# EasyEDA Pro project GController.eprj, schematic NController, sheets 5 to 10 of 17

## Sheets
5 RS485: Create Date: 2024-09-24
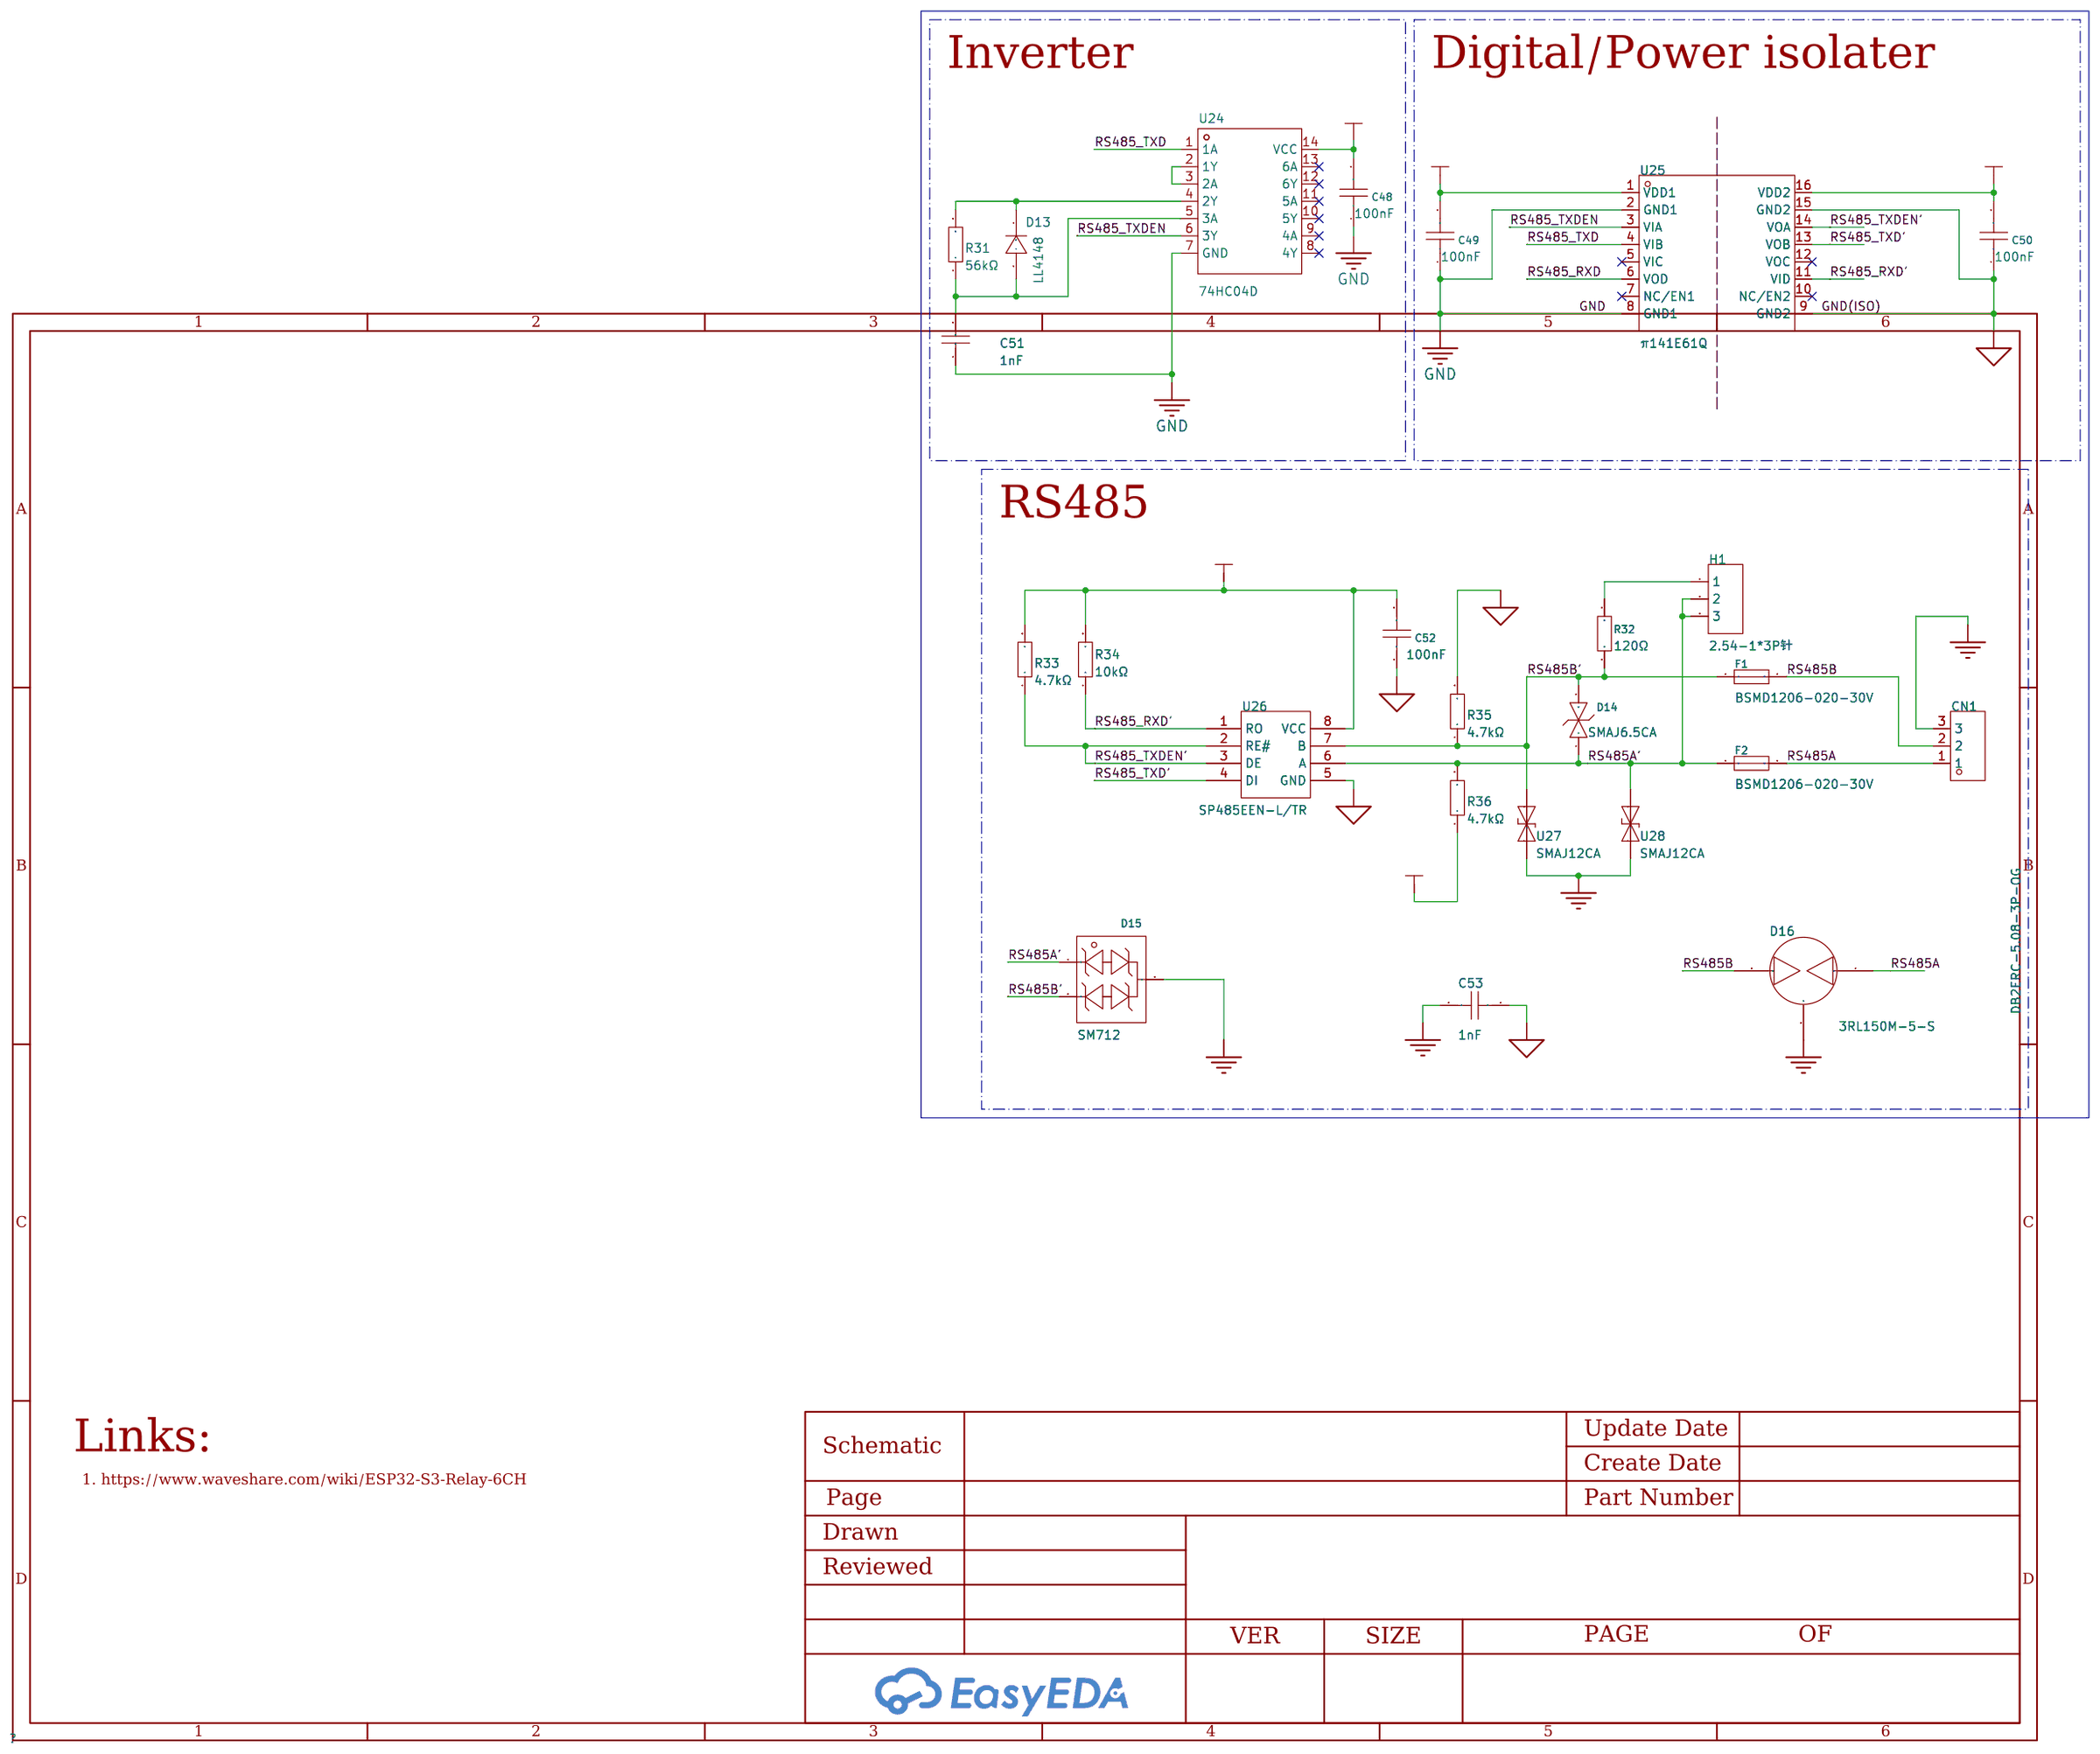
[diagram p4: RS485]
6 RTC: Create Date: 2024-09-24
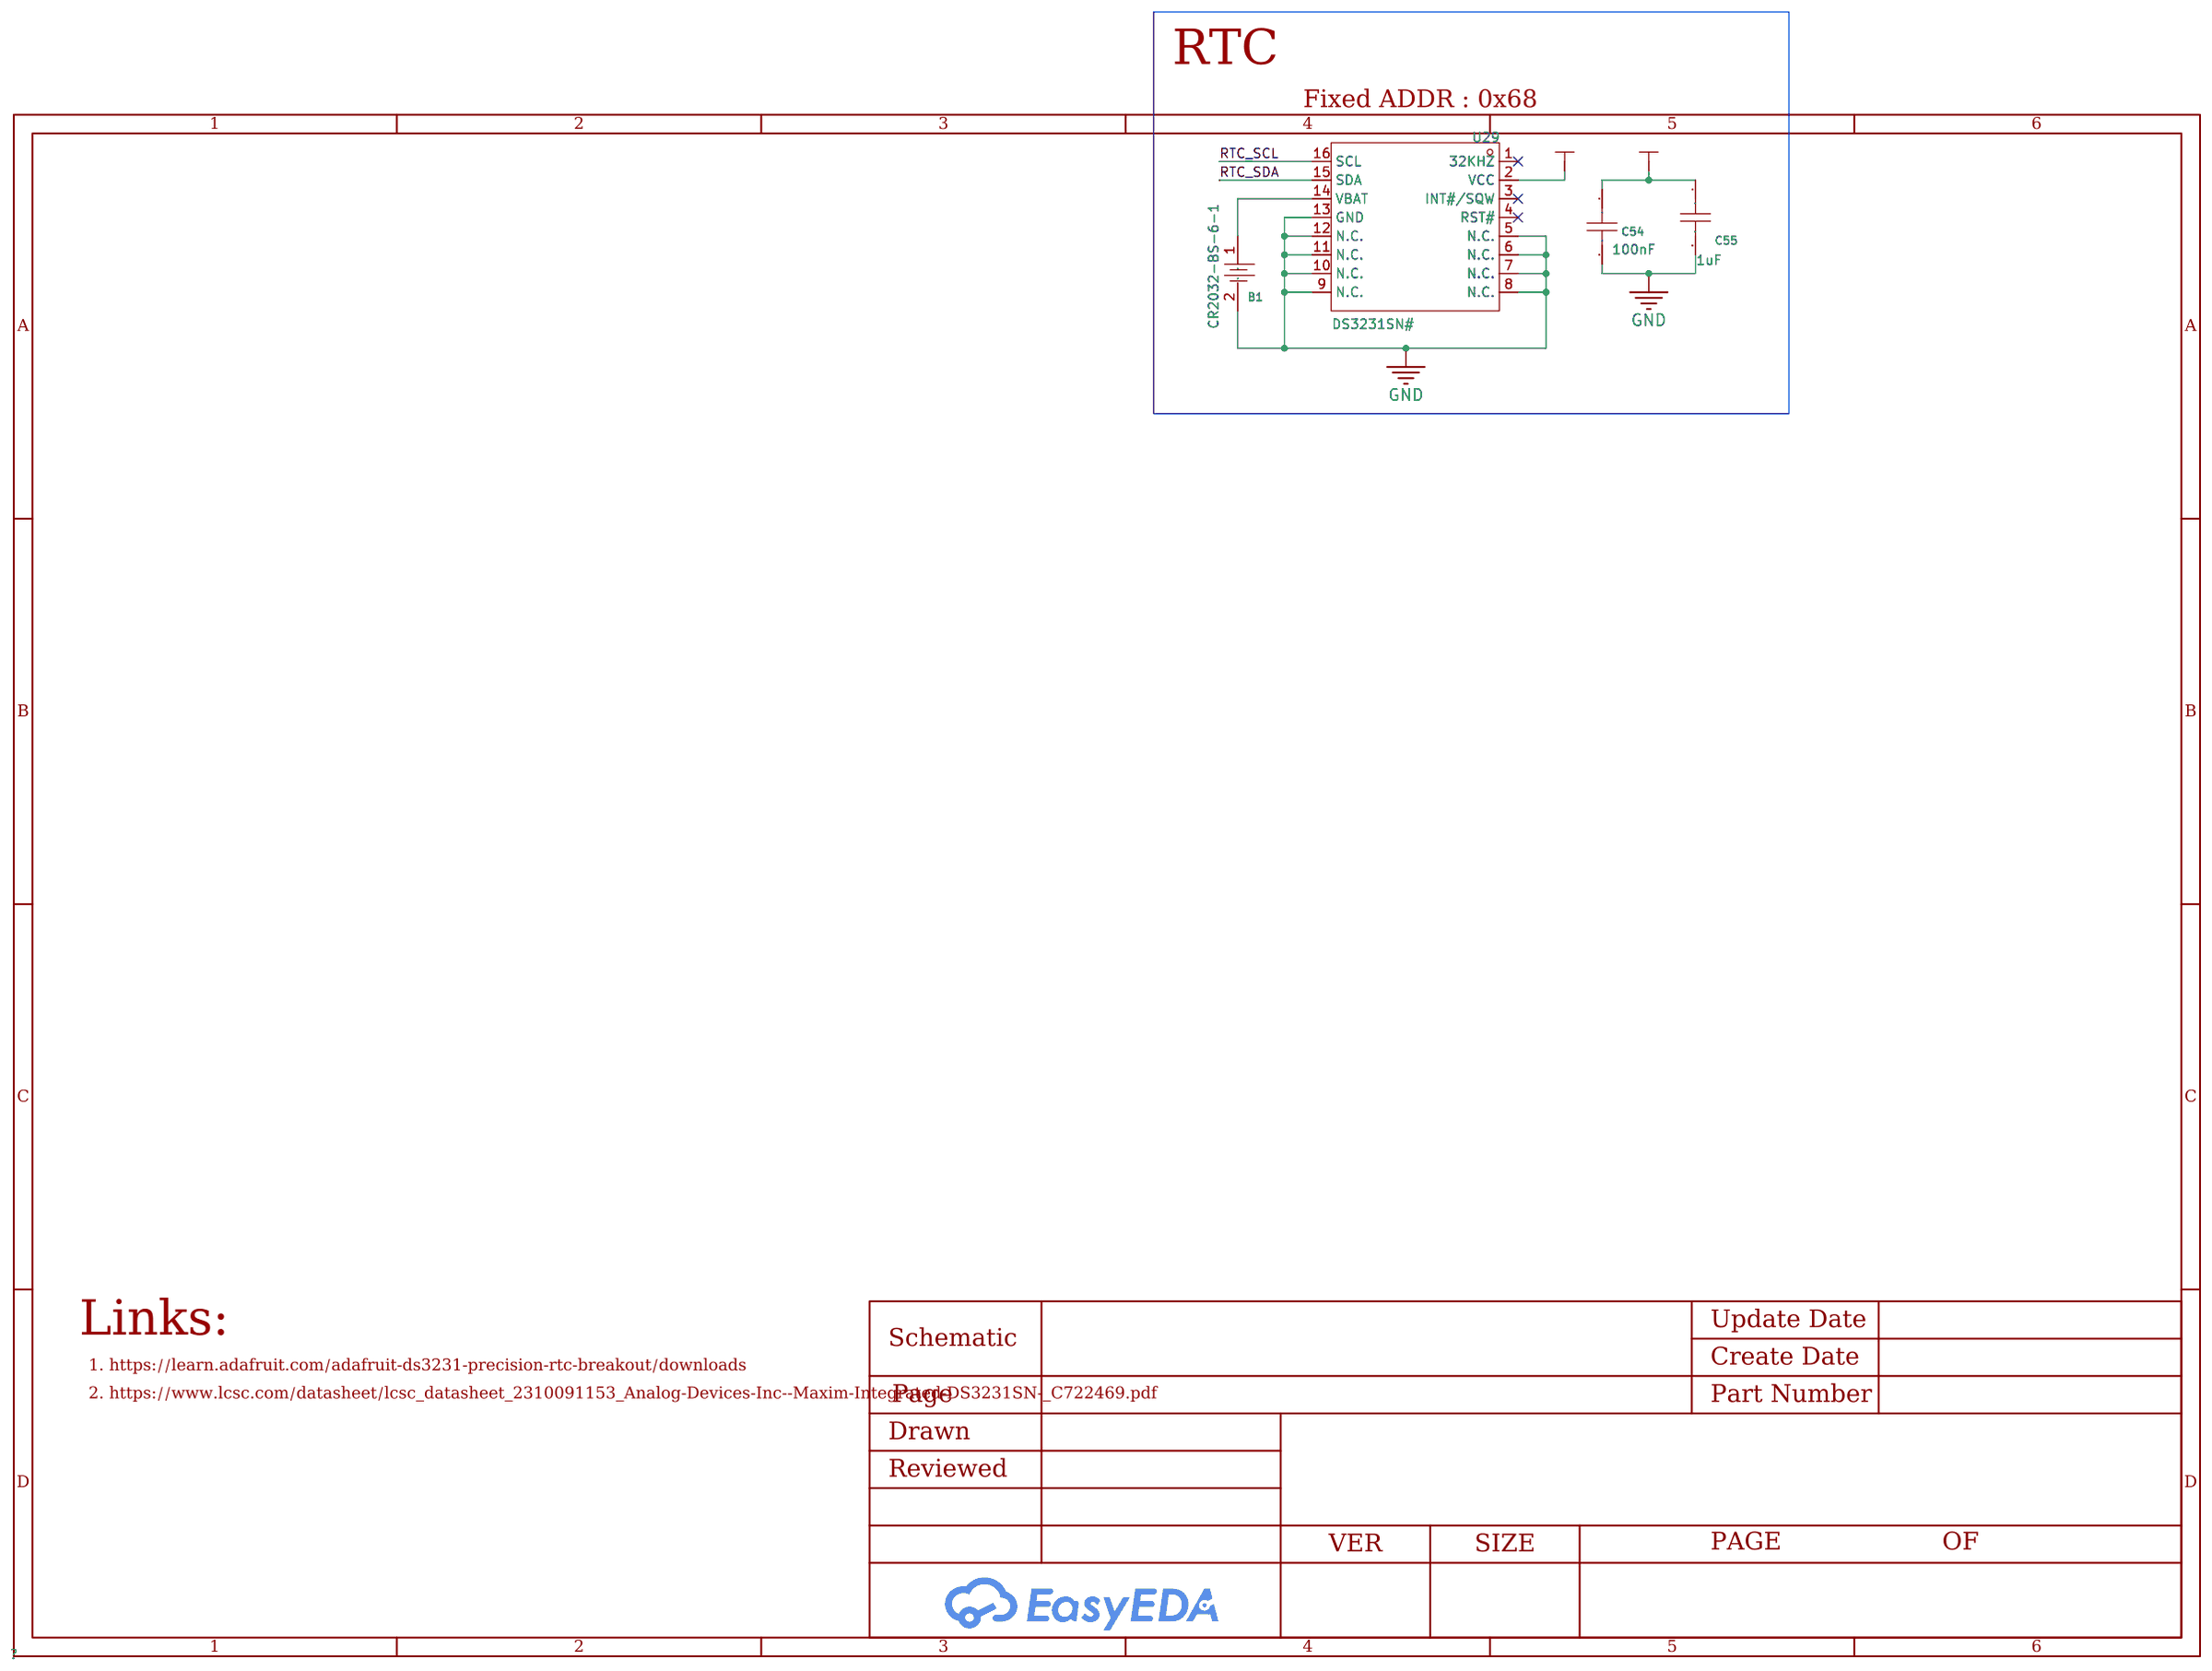
[diagram p5: RTC]
7 Storage: Create Date: 2024-09-24
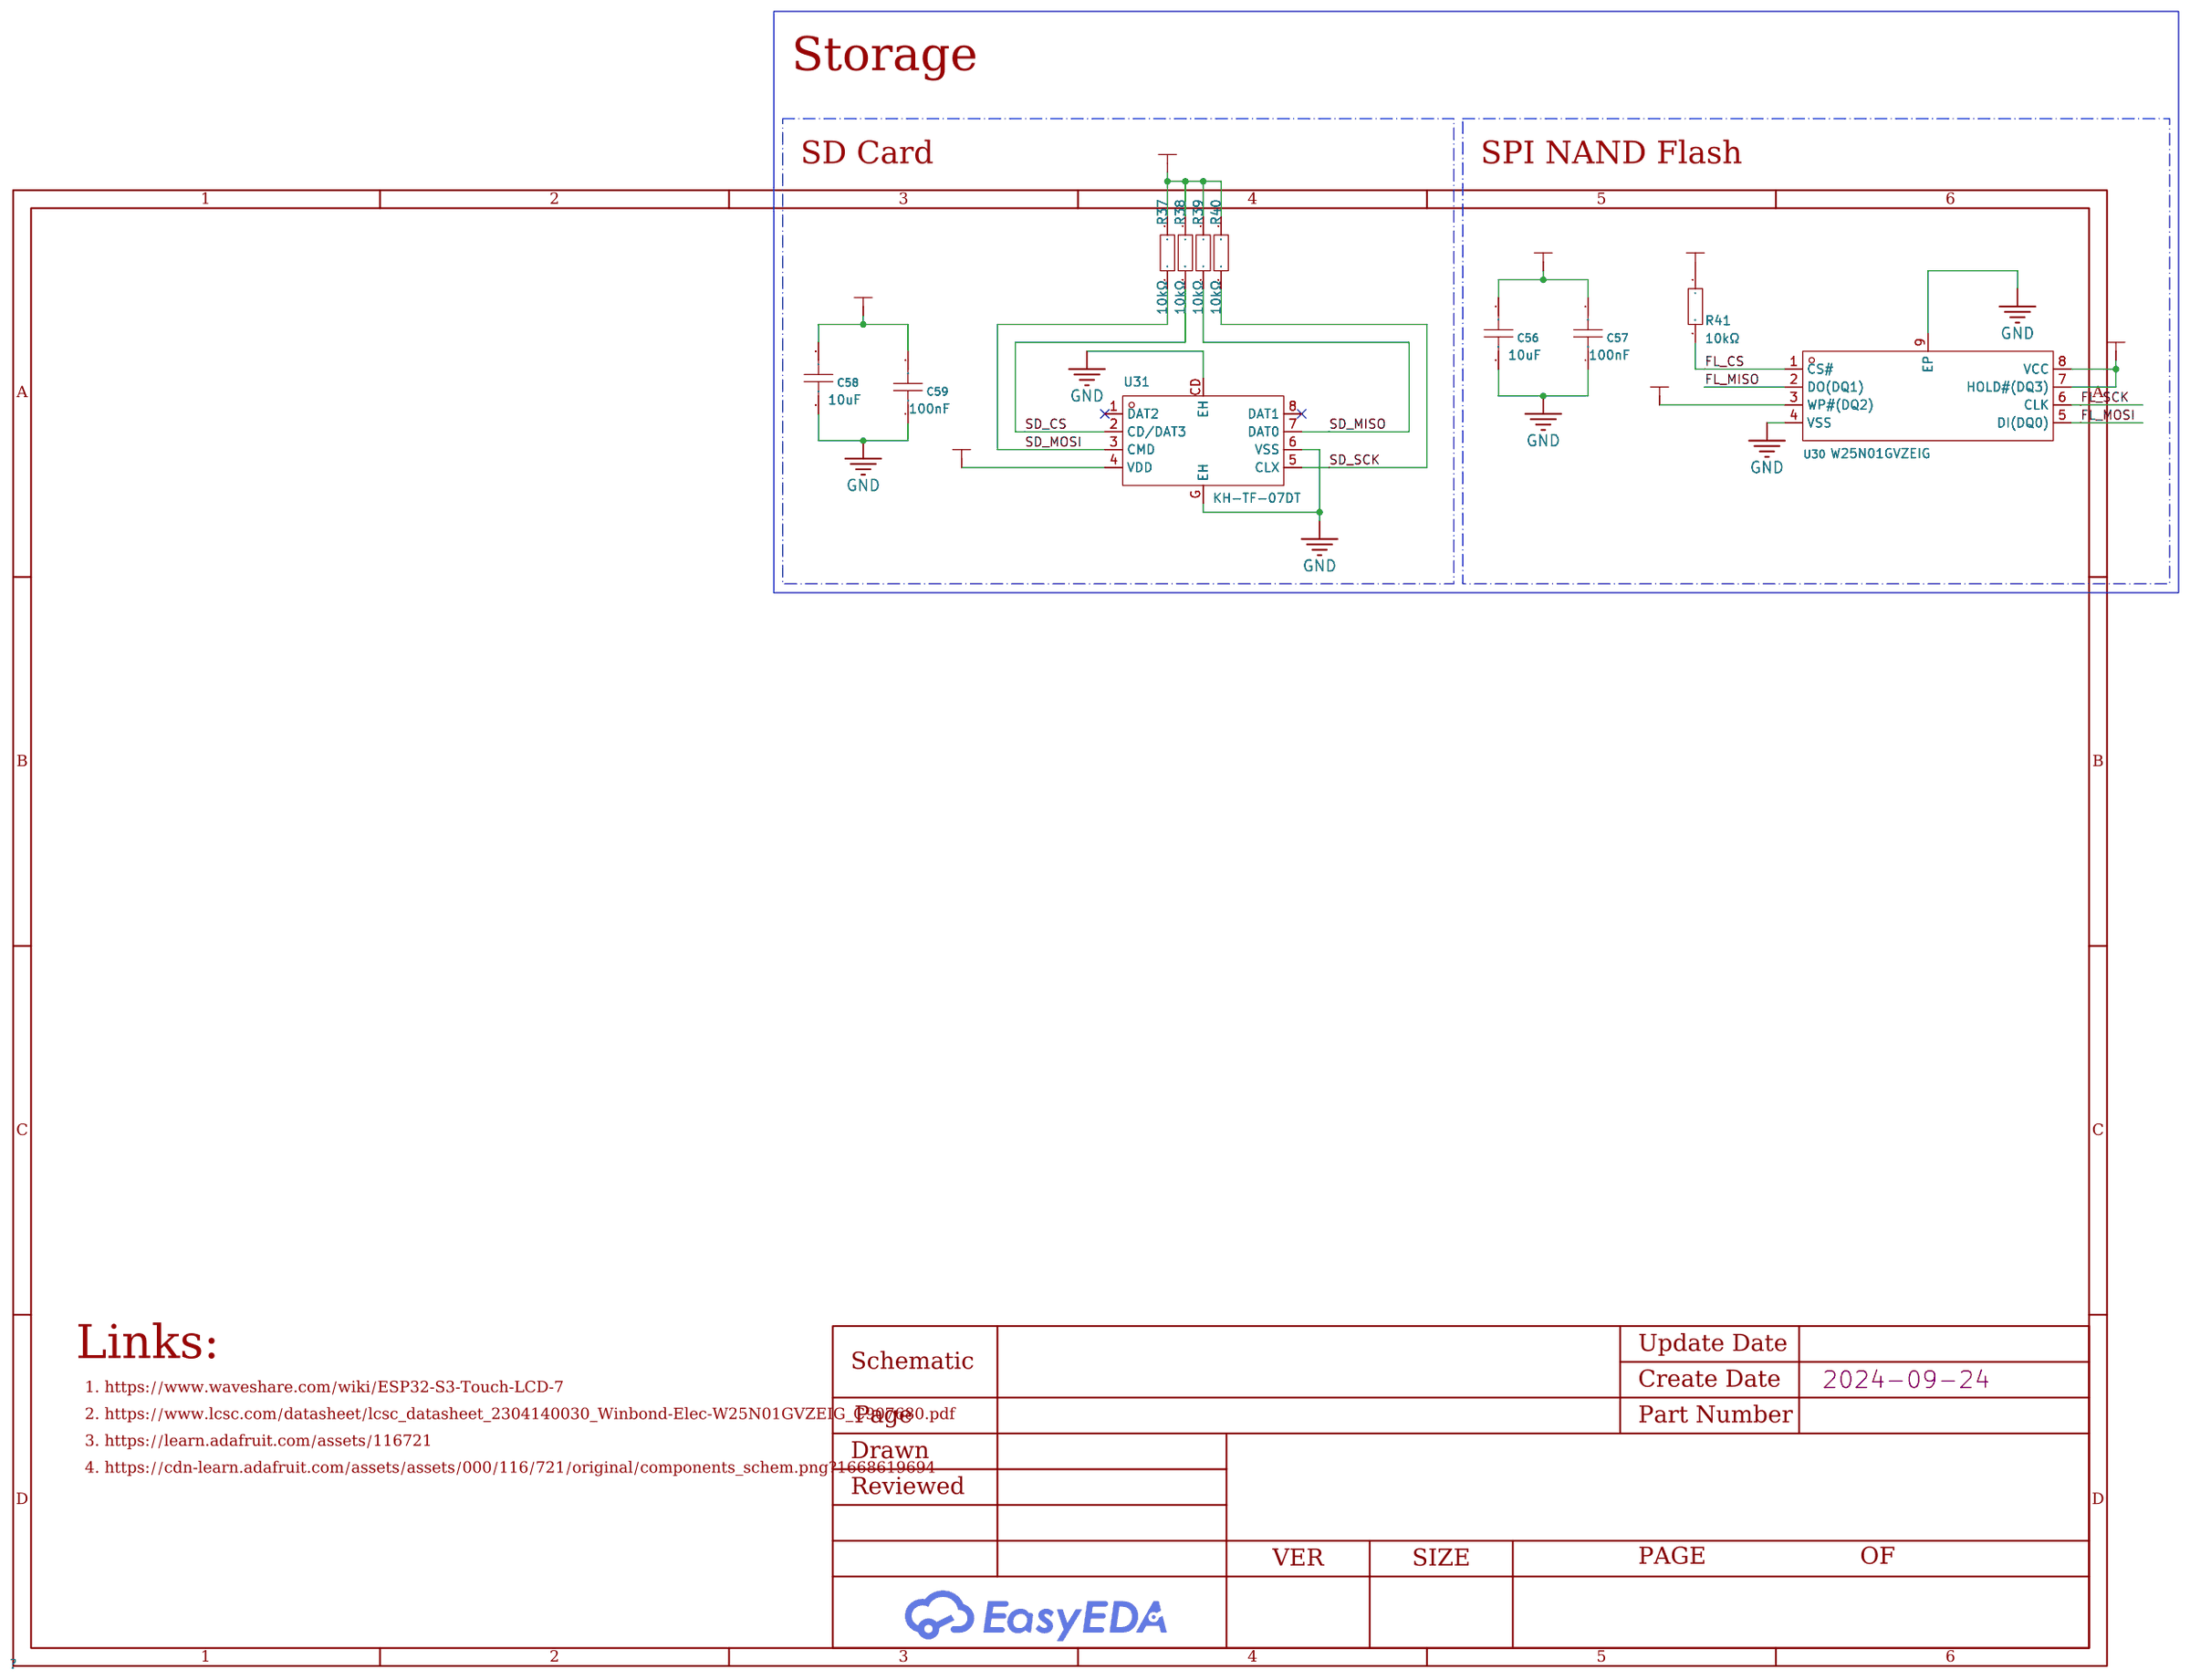
[diagram p6: Storage]
8 IO-Expander: Create Date: 2024-09-24
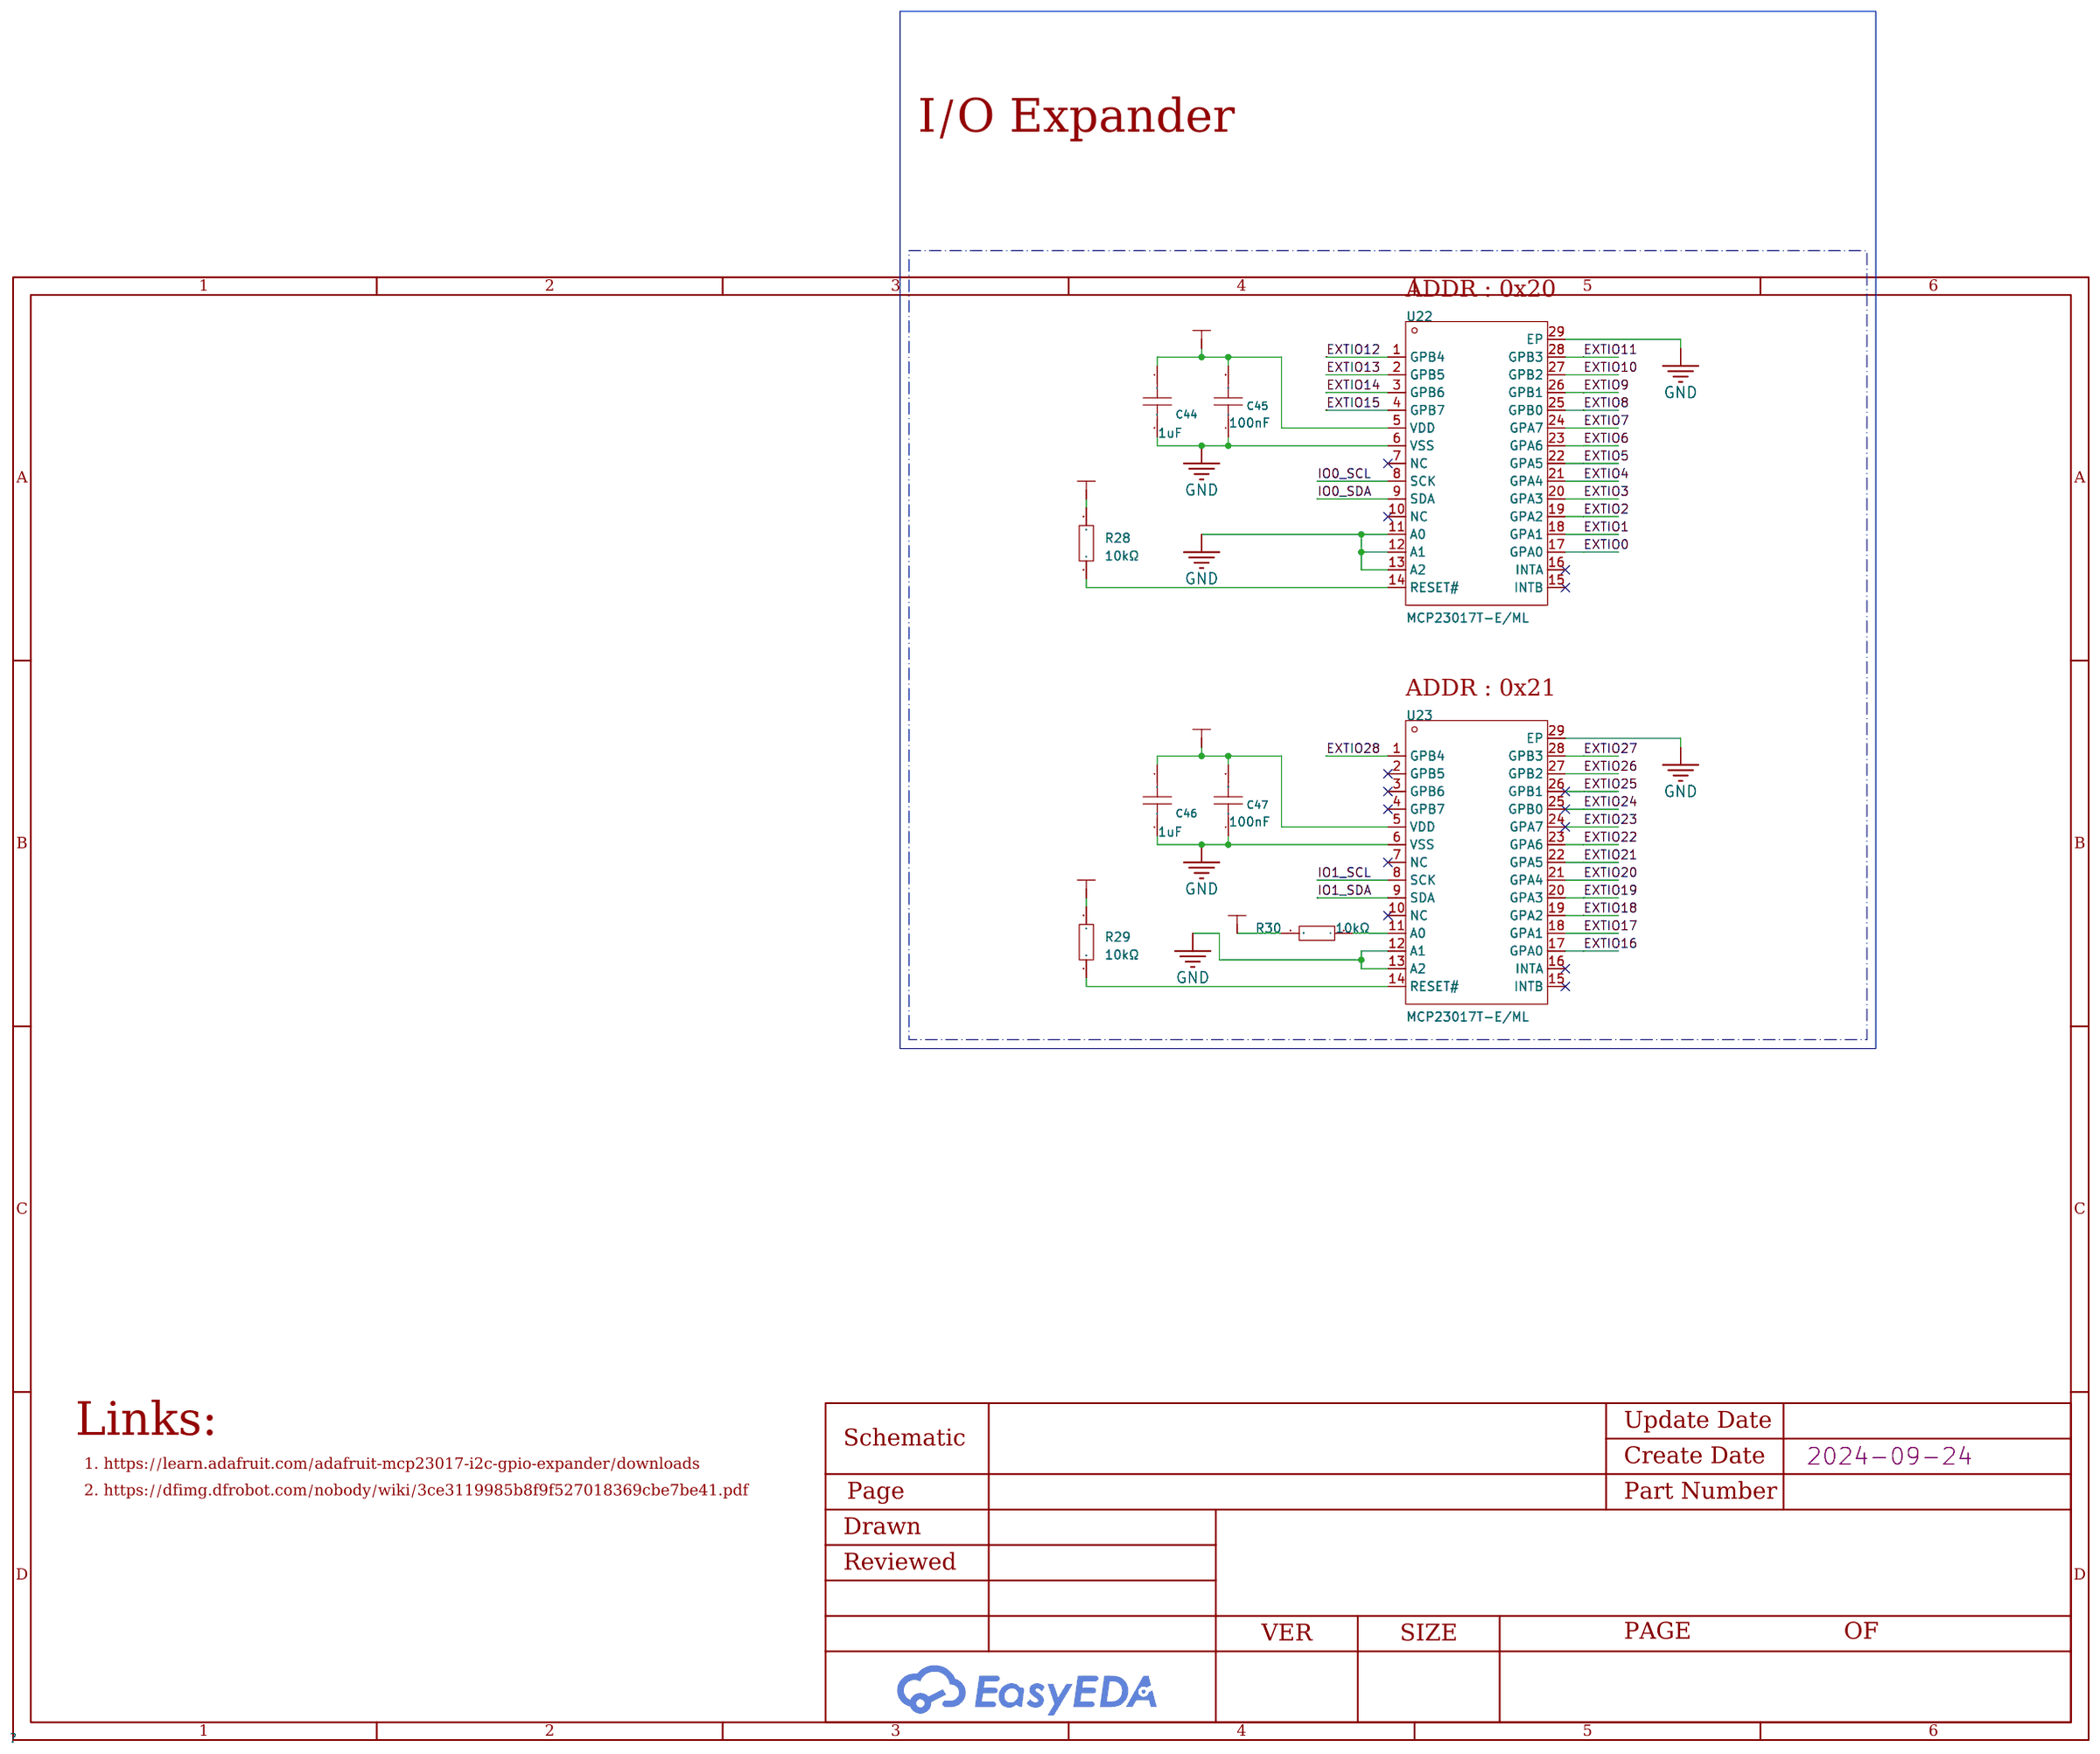
[diagram p7: IO-Expander]
9 Digital-Output: Create Date: 2024-09-24
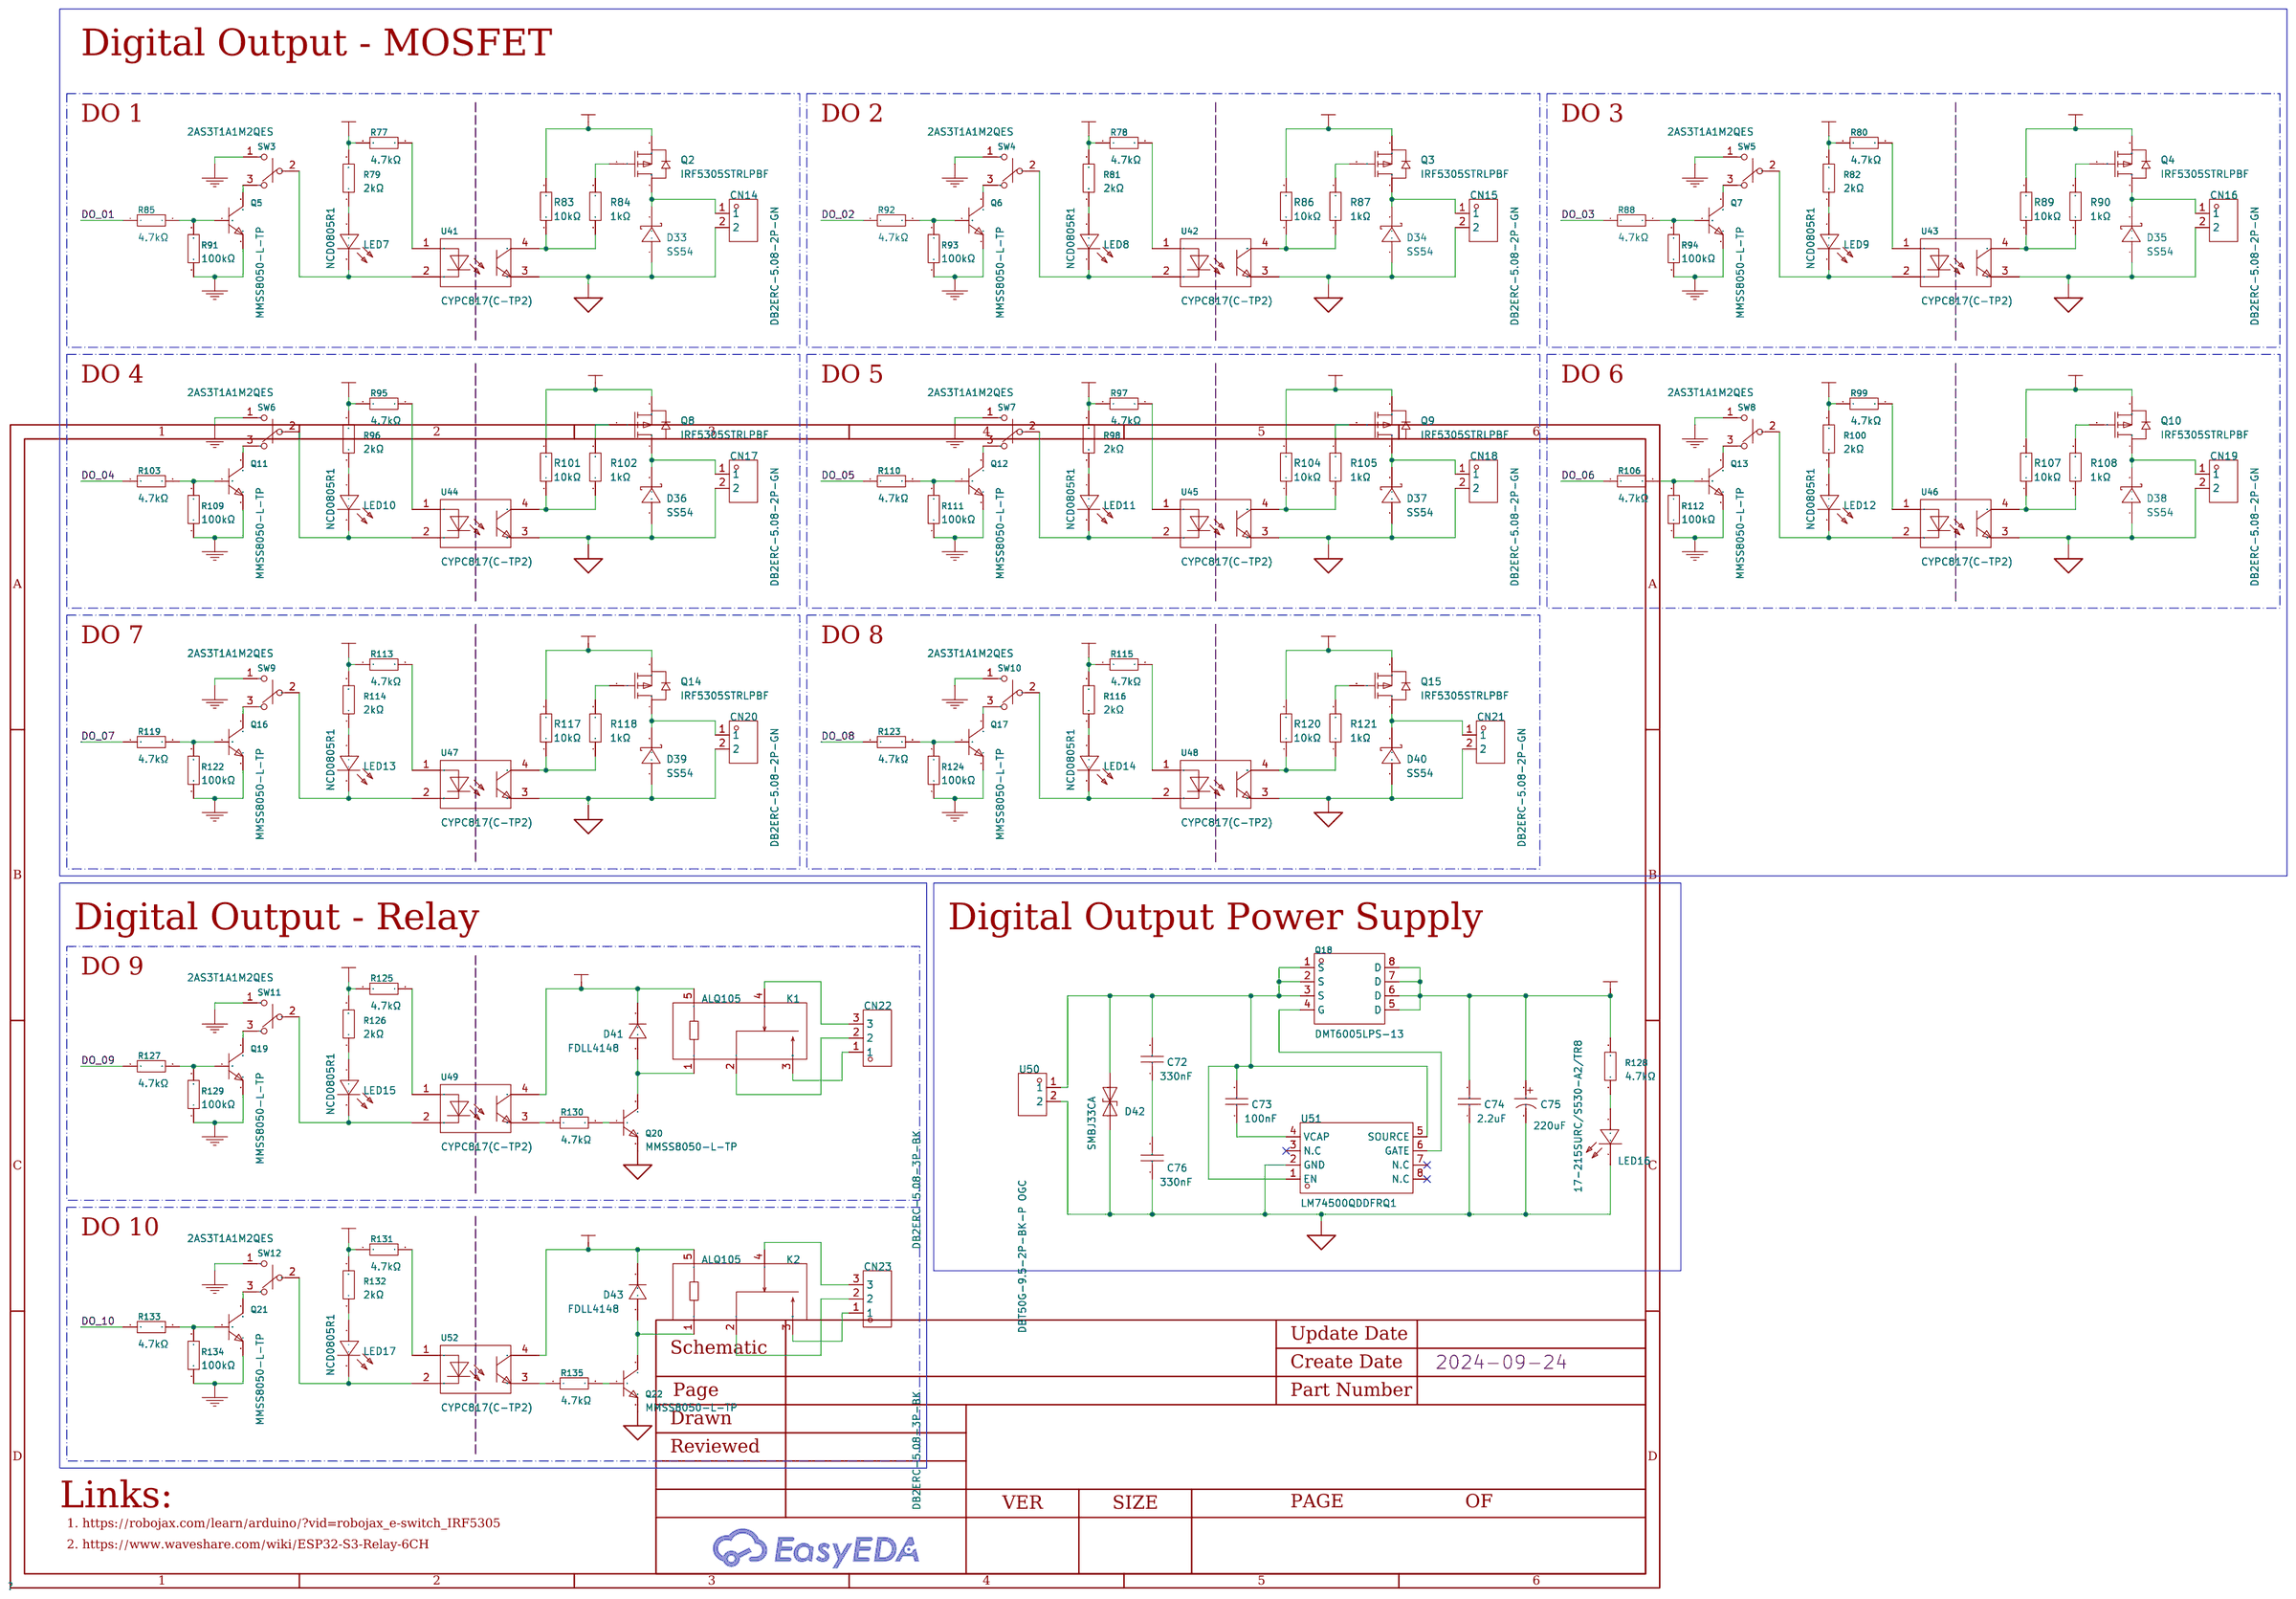
[diagram p8: Digital-Output]
10 Buzzer: Create Date: 2024-09-24
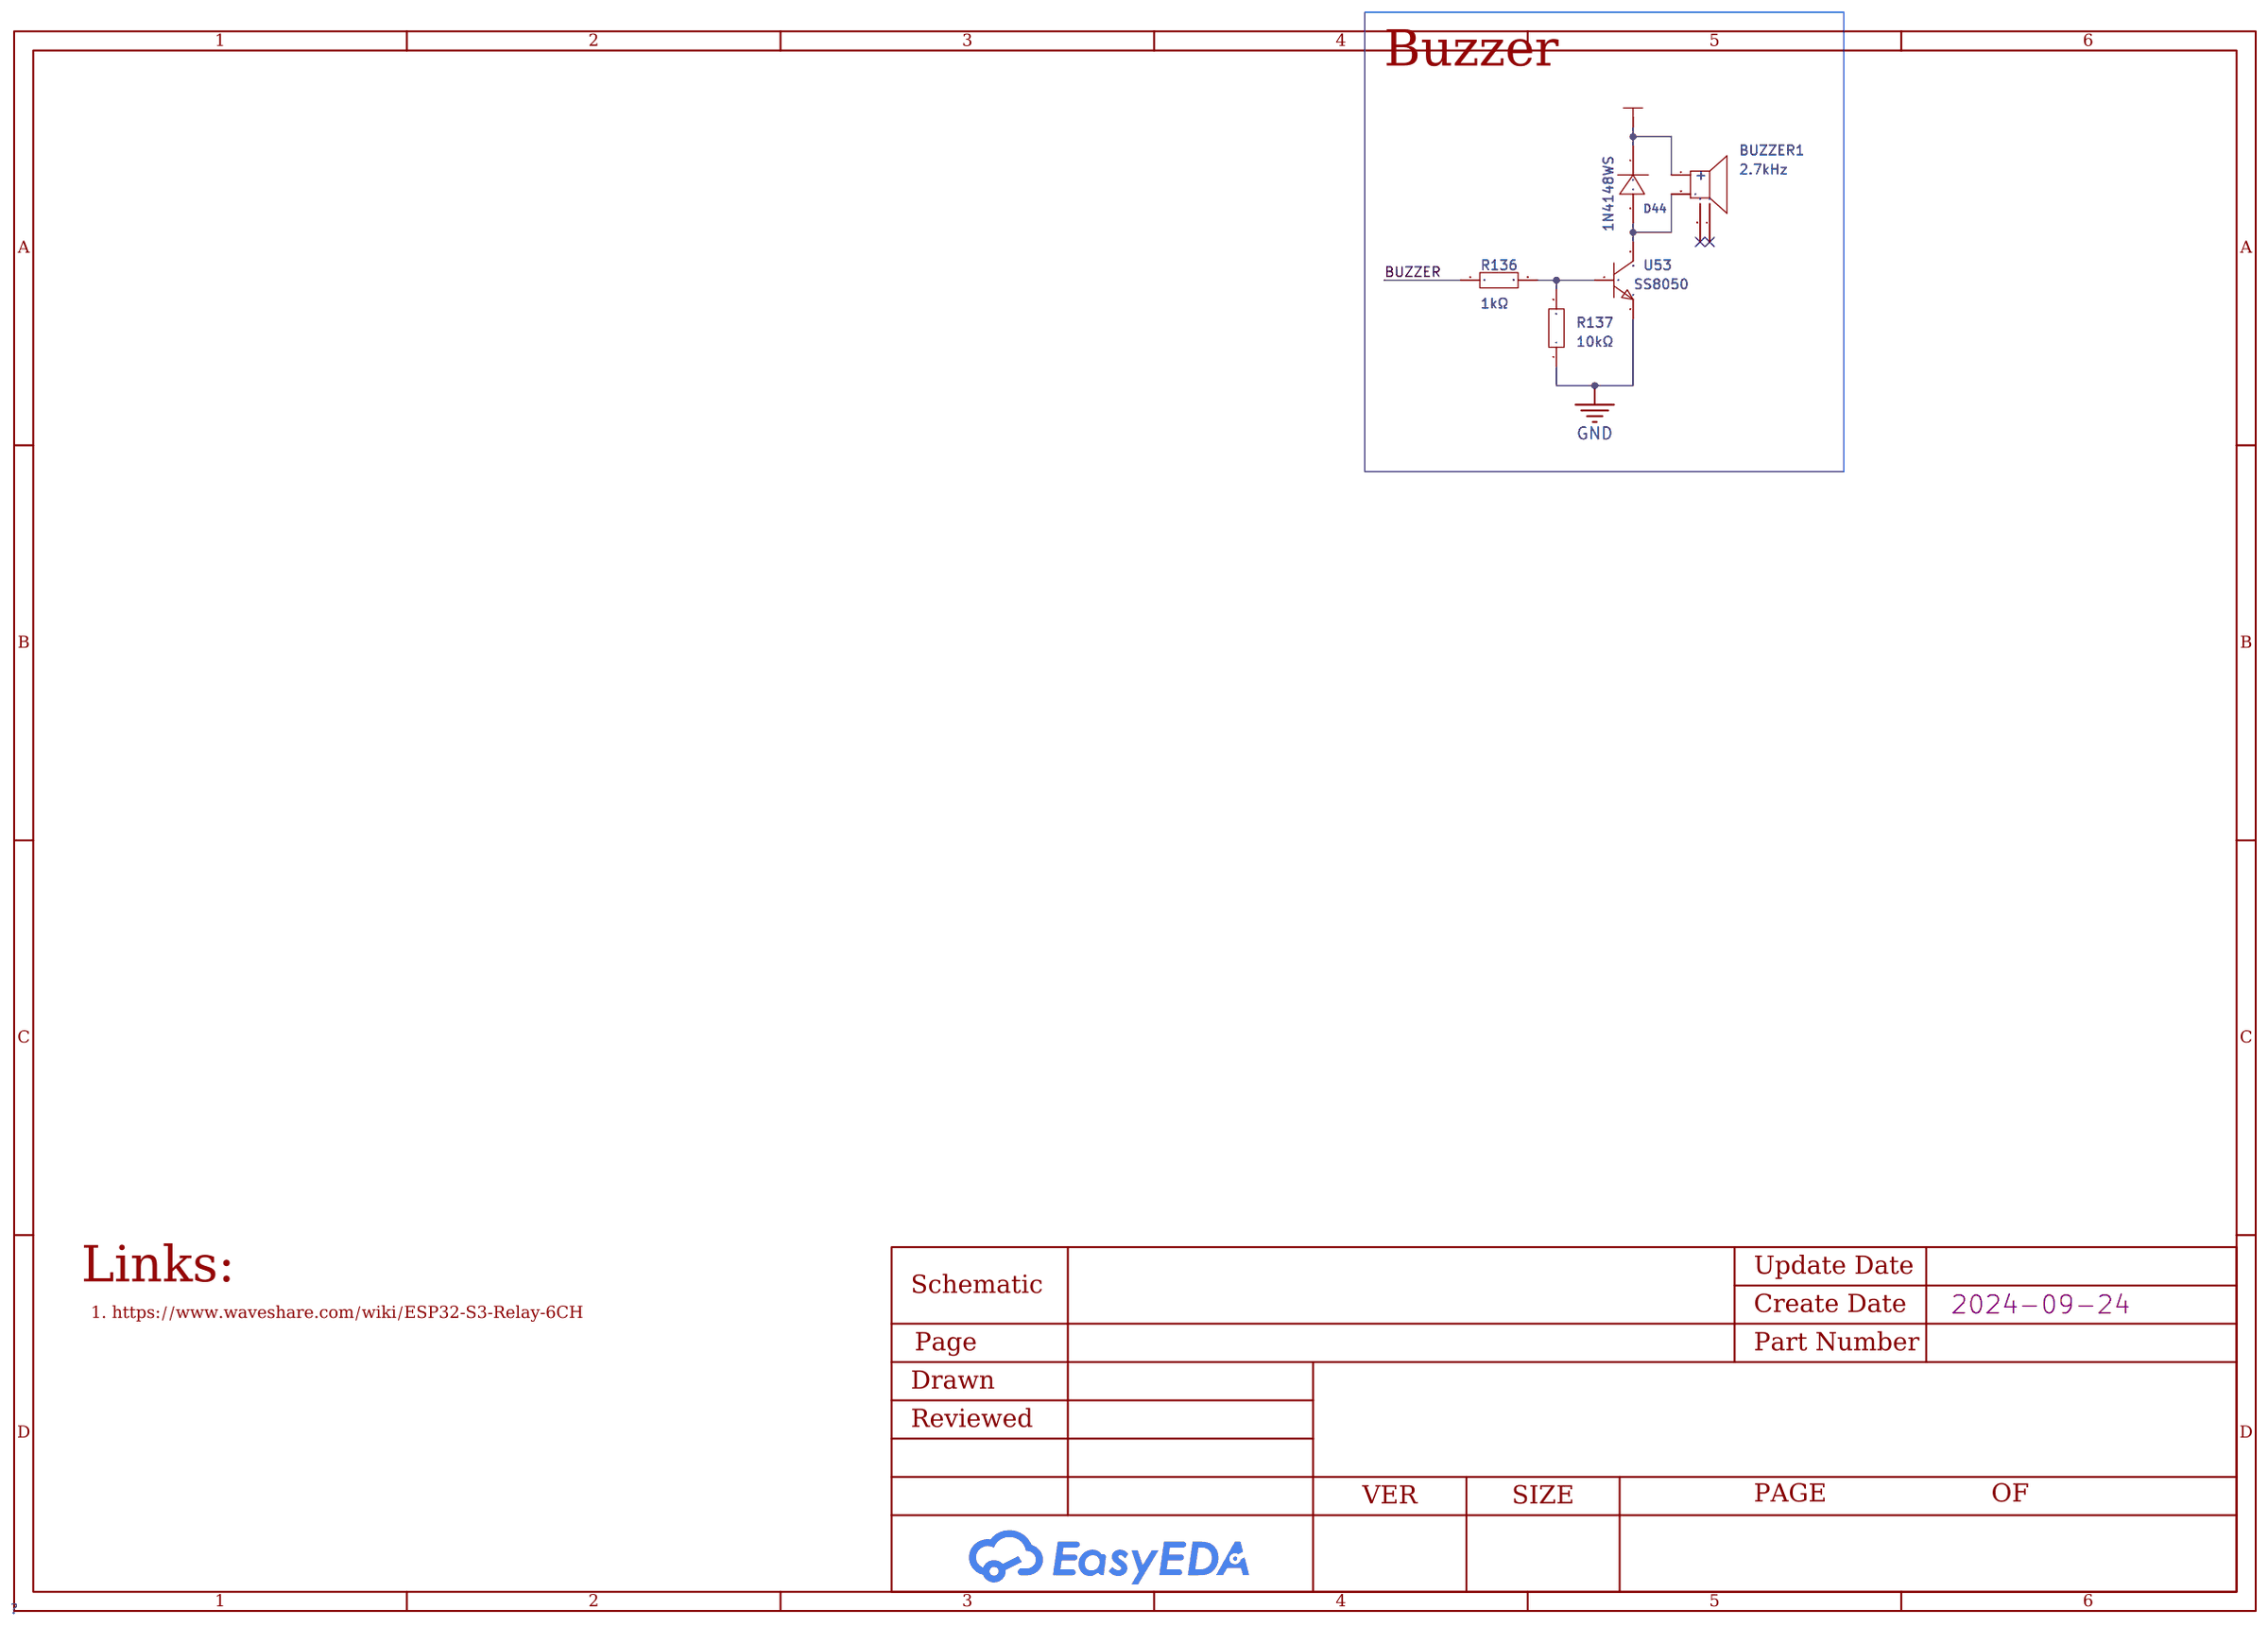
[diagram p9: Buzzer]

## Parts
sheet Buzzer
BUZZER1  2.7kHz  [BUZ-SMD_4P-L8.5-W8.5-P8.50-BR]
D44  1N4148WS  [SOD-323_L1.8-W1.3-LS2.5-RD]
R136  1kΩ  [R0603]
R137  10kΩ  [R0603]
U53  SS8050  [SOT-23-3_L2.9-W1.3-P1.90-LS2.4-BR]
sheet Digital-Output
C72  330nF  [C1206]
C73  100nF  [C0603]
C74  2.2uF  [C1210]
C75  220uF  [CAP-SMD_BD10.0-L10.3-W10.3-LS11.3-FD]
C76  330nF  [C1206]
CN14  DB2ERC-5.08-2P-GN  [CONN-TH_2P-P5.08_DB2ERC-5.08-2P]
CN15  DB2ERC-5.08-2P-GN  [CONN-TH_2P-P5.08_DB2ERC-5.08-2P]
CN16  DB2ERC-5.08-2P-GN  [CONN-TH_2P-P5.08_DB2ERC-5.08-2P]
CN17  DB2ERC-5.08-2P-GN  [CONN-TH_2P-P5.08_DB2ERC-5.08-2P]
CN18  DB2ERC-5.08-2P-GN  [CONN-TH_2P-P5.08_DB2ERC-5.08-2P]
CN19  DB2ERC-5.08-2P-GN  [CONN-TH_2P-P5.08_DB2ERC-5.08-2P]
CN20  DB2ERC-5.08-2P-GN  [CONN-TH_2P-P5.08_DB2ERC-5.08-2P]
CN21  DB2ERC-5.08-2P-GN  [CONN-TH_2P-P5.08_DB2ERC-5.08-2P]
CN22  DB2ERC-5.08-3P-BK  [CONN-TH_3P-P5.08_DB2ERC-5.08-3P-BK]
CN23  DB2ERC-5.08-3P-BK  [CONN-TH_3P-P5.08_DB2ERC-5.08-3P-BK]
D33  SS54  [SMA_L4.4-W2.8-LS5.4-R-RD]
D34  SS54  [SMA_L4.4-W2.8-LS5.4-R-RD]
D35  SS54  [SMA_L4.4-W2.8-LS5.4-R-RD]
D36  SS54  [SMA_L4.4-W2.8-LS5.4-R-RD]
D37  SS54  [SMA_L4.4-W2.8-LS5.4-R-RD]
D38  SS54  [SMA_L4.4-W2.8-LS5.4-R-RD]
D39  SS54  [SMA_L4.4-W2.8-LS5.4-R-RD]
D40  SS54  [SMA_L4.4-W2.8-LS5.4-R-RD]
D41  FDLL4148  [SOD-80_L3.5-W1.5-RD]
D42  SMBJ33CA  [SMB_L4.3-W3.6-LS5.4-BI]
D43  FDLL4148  [SOD-80_L3.5-W1.5-RD]
K1  ALQ105  [RELAY-TH_ALQ1XX]
K2  ALQ105  [RELAY-TH_ALQ1XX]
LED7  NCD0805R1  [LED0805-R-RD]
LED8  NCD0805R1  [LED0805-R-RD]
LED9  NCD0805R1  [LED0805-R-RD]
LED10  NCD0805R1  [LED0805-R-RD]
LED11  NCD0805R1  [LED0805-R-RD]
LED12  NCD0805R1  [LED0805-R-RD]
LED13  NCD0805R1  [LED0805-R-RD]
LED14  NCD0805R1  [LED0805-R-RD]
LED15  NCD0805R1  [LED0805-R-RD]
LED16  17-215SURC/S530-A2/TR8  [LED0805-RD_RED]
LED17  NCD0805R1  [LED0805-R-RD]
Q2  IRF5305STRLPBF  [TO-263-2_L10.0-W9.1-P5.08-LS15.2-TL]
Q3  IRF5305STRLPBF  [TO-263-2_L10.0-W9.1-P5.08-LS15.2-TL]
Q4  IRF5305STRLPBF  [TO-263-2_L10.0-W9.1-P5.08-LS15.2-TL]
Q5  MMSS8050-L-TP  [SOT-23-3_L2.9-W1.3-P1.90-LS2.4-BR]
Q6  MMSS8050-L-TP  [SOT-23-3_L2.9-W1.3-P1.90-LS2.4-BR]
Q7  MMSS8050-L-TP  [SOT-23-3_L2.9-W1.3-P1.90-LS2.4-BR]
Q8  IRF5305STRLPBF  [TO-263-2_L10.0-W9.1-P5.08-LS15.2-TL]
Q9  IRF5305STRLPBF  [TO-263-2_L10.0-W9.1-P5.08-LS15.2-TL]
Q10  IRF5305STRLPBF  [TO-263-2_L10.0-W9.1-P5.08-LS15.2-TL]
Q11  MMSS8050-L-TP  [SOT-23-3_L2.9-W1.3-P1.90-LS2.4-BR]
Q12  MMSS8050-L-TP  [SOT-23-3_L2.9-W1.3-P1.90-LS2.4-BR]
Q13  MMSS8050-L-TP  [SOT-23-3_L2.9-W1.3-P1.90-LS2.4-BR]
Q14  IRF5305STRLPBF  [TO-263-2_L10.0-W9.1-P5.08-LS15.2-TL]
Q15  IRF5305STRLPBF  [TO-263-2_L10.0-W9.1-P5.08-LS15.2-TL]
Q16  MMSS8050-L-TP  [SOT-23-3_L2.9-W1.3-P1.90-LS2.4-BR]
Q17  MMSS8050-L-TP  [SOT-23-3_L2.9-W1.3-P1.90-LS2.4-BR]
Q18  DMT6005LPS-13  [DFN-8_L6.0-W5.1-P1.27-LS6.2-BL]
Q19  MMSS8050-L-TP  [SOT-23-3_L2.9-W1.3-P1.90-LS2.4-BR]
Q20  MMSS8050-L-TP  [SOT-23-3_L2.9-W1.3-P1.90-LS2.4-BR]
Q21  MMSS8050-L-TP  [SOT-23-3_L2.9-W1.3-P1.90-LS2.4-BR]
Q22  MMSS8050-L-TP  [SOT-23-3_L2.9-W1.3-P1.90-LS2.4-BR]
R77  4.7kΩ  [R0805]
R78  4.7kΩ  [R0805]
R79  2kΩ  [R0805]
R80  4.7kΩ  [R0805]
R81  2kΩ  [R0805]
R82  2kΩ  [R0805]
R83  10kΩ  [R0603]
R84  1kΩ  [R0603]
R85  4.7kΩ  [R0805]
R86  10kΩ  [R0603]
R87  1kΩ  [R0603]
R88  4.7kΩ  [R0805]
R89  10kΩ  [R0603]
R90  1kΩ  [R0603]
R91  100kΩ  [R0805]
R92  4.7kΩ  [R0805]
R93  100kΩ  [R0805]
R94  100kΩ  [R0805]
R95  4.7kΩ  [R0805]
R96  2kΩ  [R0805]
R97  4.7kΩ  [R0805]
R98  2kΩ  [R0805]
R99  4.7kΩ  [R0805]
R100  2kΩ  [R0805]
R101  10kΩ  [R0603]
R102  1kΩ  [R0603]
R103  4.7kΩ  [R0805]
R104  10kΩ  [R0603]
R105  1kΩ  [R0603]
R106  4.7kΩ  [R0805]
R107  10kΩ  [R0603]
R108  1kΩ  [R0603]
R109  100kΩ  [R0805]
R110  4.7kΩ  [R0805]
R111  100kΩ  [R0805]
R112  100kΩ  [R0805]
R113  4.7kΩ  [R0805]
R114  2kΩ  [R0805]
R115  4.7kΩ  [R0805]
R116  2kΩ  [R0805]
R117  10kΩ  [R0603]
R118  1kΩ  [R0603]
R119  4.7kΩ  [R0805]
R120  10kΩ  [R0603]
R121  1kΩ  [R0603]
R122  100kΩ  [R0805]
R123  4.7kΩ  [R0805]
R124  100kΩ  [R0805]
R125  4.7kΩ  [R0805]
R126  2kΩ  [R0805]
R127  4.7kΩ  [R0805]
R128  4.7kΩ  [R1206]
R129  100kΩ  [R0805]
R130  4.7kΩ  [R0805]
R131  4.7kΩ  [R0805]
R132  2kΩ  [R0805]
R133  4.7kΩ  [R0805]
R134  100kΩ  [R0805]
R135  4.7kΩ  [R0805]
SW3  2AS3T1A1M2QES  [SW-TH_2AS3T1A1M2QES]
SW4  2AS3T1A1M2QES  [SW-TH_2AS3T1A1M2QES]
SW5  2AS3T1A1M2QES  [SW-TH_2AS3T1A1M2QES]
SW6  2AS3T1A1M2QES  [SW-TH_2AS3T1A1M2QES]
SW7  2AS3T1A1M2QES  [SW-TH_2AS3T1A1M2QES]
SW8  2AS3T1A1M2QES  [SW-TH_2AS3T1A1M2QES]
SW9  2AS3T1A1M2QES  [SW-TH_2AS3T1A1M2QES]
SW10  2AS3T1A1M2QES  [SW-TH_2AS3T1A1M2QES]
SW11  2AS3T1A1M2QES  [SW-TH_2AS3T1A1M2QES]
SW12  2AS3T1A1M2QES  [SW-TH_2AS3T1A1M2QES]
U41  CYPC817(C-TP2)  [SOP-4_L6.4-W4.6-P2.54-LS10.2-TL]
U42  CYPC817(C-TP2)  [SOP-4_L6.4-W4.6-P2.54-LS10.2-TL]
U43  CYPC817(C-TP2)  [SOP-4_L6.4-W4.6-P2.54-LS10.2-TL]
U44  CYPC817(C-TP2)  [SOP-4_L6.4-W4.6-P2.54-LS10.2-TL]
U45  CYPC817(C-TP2)  [SOP-4_L6.4-W4.6-P2.54-LS10.2-TL]
U46  CYPC817(C-TP2)  [SOP-4_L6.4-W4.6-P2.54-LS10.2-TL]
U47  CYPC817(C-TP2)  [SOP-4_L6.4-W4.6-P2.54-LS10.2-TL]
U48  CYPC817(C-TP2)  [SOP-4_L6.4-W4.6-P2.54-LS10.2-TL]
U49  CYPC817(C-TP2)  [SOP-4_L6.4-W4.6-P2.54-LS10.2-TL]
U50  DBT50G-9.5-2P-BK-P OGC  [CONN-TH_2P-P9.50_DBT50G-9.5-2P]
U51  LM74500QDDFRQ1  [SOT-23-8_L3.0-W1.7-P0.65-LS2.8-BR]
U52  CYPC817(C-TP2)  [SOP-4_L6.4-W4.6-P2.54-LS10.2-TL]
sheet IO-Expander
C44  1uF  [C0603]
C45  100nF  [C0603]
C46  1uF  [C0603]
C47  100nF  [C0603]
R28  10kΩ  [R0603]
R29  10kΩ  [R0603]
R30  10kΩ  [R0603]
U22  MCP23017T-E/ML  [QFN-28_L6.0-W6.0-P0.65-BL-EP3.7]
U23  MCP23017T-E/ML  [QFN-28_L6.0-W6.0-P0.65-BL-EP3.7]
sheet RS485
C48  100nF  [C0603]
C49  100nF  [C0603]
C50  100nF  [C0603]
C51  1nF  [C0603]
C52  100nF  [C0603]
C53  1nF  [C1206]
CN1  DB2ERC-5.08-3P-OG  [CONN-TH_3P-P5.08_DB2ERC-5.08-3P-OG]
D13  LL4148  [LL-34_L3.5-W1.5-RD]
D14  SMAJ6.5CA  [SMA_L4.3-W2.6-LS5.1-BI]
D15  SM712  [SOT-23-3_L2.9-W1.6-P1.90-LS2.8-BR]
D16  3RL150M-5-S  [DIO-DT-SMD_3P-BD5.0-L7.2-P3.30]
F1  BSMD1206-020-30V  [F1206]
F2  BSMD1206-020-30V  [F1206]
H1  2.54-1*3P针  [HDR-TH_3P-P2.54-V-M-1]
R31  56kΩ  [R0603]
R32  120Ω  [R0603]
R33  4.7kΩ  [R0603]
R34  10kΩ  [R0603]
R35  4.7kΩ  [R0603]
R36  4.7kΩ  [R0603]
U24  74HC04D  [SOIC-14_L8.7-W3.9-P1.27-LS6.0-BL]
U25  π141E61Q  [WSOIC-16_L10.3-W7.5-P1.27-LS10.3-BL]
U26  SP485EEN-L/TR  [SOIC-8_L5.0-W4.0-P1.27-LS6.0-BL]
U27  SMAJ12CA  [SMA_L4.3-W2.7-LS5.1-BI]
U28  SMAJ12CA  [SMA_L4.3-W2.7-LS5.1-BI]
sheet RTC
B1  CR2032-BS-6-1  [BAT-TH_CR2032-BS-6-1]
C54  100nF  [C0603]
C55  1uF  [C0603]
U29  DS3231SN#  [SOIC-16_L10.3-W7.5-P1.27-LS10.3-BL]
sheet Storage
C56  10uF  [C0603]
C57  100nF  [C0603]
C58  10uF  [C0603]
C59  100nF  [C0603]
R37  10kΩ  [R0603]
R38  10kΩ  [R0603]
R39  10kΩ  [R0603]
R40  10kΩ  [R0603]
R41  10kΩ  [R0603]
U30  W25N01GVZEIG  [WSON-8_L8.0-W6.10-P1.27-BL-EP]
U31  KH-TF-07DT  [SIM-SMD_C9900007362]

## Library data of the parts
BUZZER1 = MLT-8530: Supplier Part: C94599; Manufacturer: 华能; Supplier Footprint: SMD,8.5x8.5mm; JLCPCB Part Class: Extended Part; Datasheet: https://atta.szlcsc.com/upload/public/pdf/source/20170522/1495448322339.pdf; Supplier: LCSC; Oscillator Circuit: 无源(外部驱动); Technology Type: 电磁式; Operating Voltage: 2.5V~4.5V; Sound Pressure Level (SPL): 80dB@5V,10cm; Length: 8.5mm; Width: 8.5mm; Height: 3.3mm
D44 = 1N4148WS_C110221: LCSC Part Name: 电压:75V 电流:150mA; Supplier Part: C110221; Manufacturer: SHIKUES(时科); Supplier Footprint: SOD-323; JLCPCB Part Class: Extended Part; Datasheet: https://atta.szlcsc.com/upload/public/pdf/source/20170717/C110221_1500269934272820715.pdf; Supplier: LCSC; Forward Voltage (Vf@If): 1.25V@150mA; Reverse Leakage Current: 1uA@75V; Operating Temperature: -65℃~+150℃@(Tj)
R84 R87 R90 R102 R105 R108 R118 R121 R136 = RC0603FR-071KL: Type:Thick Film Resistors Resistance: Tolerance:±1% Tolerance:±1% Power(Watts): Overload Voltage (Max): Temperature Coefficient:±100ppm/℃ Temperature Coefficient:±100ppm/℃ Operating Temperature Range:-55℃~+155℃ Operating Temperature Range:-55℃~+155℃; LCSC Part Name: 厚膜电阻 1kΩ ±1% 100mW; Supplier Part: C22548; Manufacturer: YAGEO(国巨); Supplier Footprint: 0603; JLCPCB Part Class: Extended Part; Datasheet: https://atta.szlcsc.com/upload/public/pdf/source/20180316/70C0E2BDAE7FCC62C531A5A58D202EE1.pdf; Supplier: LCSC; Type: Thick Film Resistors; Tolerance: ±1%; Temperature Coefficient: ±100ppm/℃; Operating Temperature Range: -55℃~+155℃
R28-R30 R34 R37-R41 R83 R86 R89 R101 R104 R107 R117 R120 R137 = RC0603FR-0710KL: Type:Thick Film Resistors Resistance: Tolerance:±1% Tolerance:±1% Power(Watts): Overload Voltage (Max): Temperature Coefficient:±100ppm/℃ Temperature Coefficient:±100ppm/℃ Operating Temperature Range:-55℃~+155℃ Operating Temperature Range:-55℃~+155℃; LCSC Part Name: 厚膜电阻 10kΩ ±1% 100mW; Supplier Part: C98220; Manufacturer: YAGEO(国巨); Supplier Footprint: 0603; JLCPCB Part Class: Extended Part; Datasheet: https://atta.szlcsc.com/upload/public/pdf/source/20180927/C295883_E8D83085EA81BD7DE0B2B681138C15EE.pdf; Supplier: LCSC; Type: Thick Film Resistors; Tolerance: ±1%; Temperature Coefficient: ±100ppm/℃; Operating Temperature Range: -55℃~+155℃
U53 = SS8050_C5184428: LCSC Part Name: NPN 电流:1.5A 耐压:25V; Supplier Part: C5184428; Manufacturer: HXY MOSFET(华轩阳电子); Supplier Footprint: SOT-23; JLCPCB Part Class: Extended Part; Datasheet: https://atta.szlcsc.com/upload/public/pdf/source/20220926/2A7E848C95898264372D5DAC9B37DDE9.pdf; Supplier: LCSC; DC Current Gain (hFE@Ic,Vce): 200@100mA,1V; Transition Frequency (fT): 100MHz; Collector Cut-Off Current (Icbo): 100nA; Collector-Emitter Saturation Voltage (VCE(sat)@Ic,Ib): 500mV@800mA,80mA
C72 C76 = 1206B334K500NT: Capacitance:330nF Tolerance:±10% Tolerance:±10% Voltage Rated: Temperature Coefficient:; LCSC Part Name: 330nF ±10% 50V; Supplier Part: C1865; Manufacturer: FH(风华); Supplier Footprint: 1206; JLCPCB Part Class: Extended Part; Datasheet: https://atta.szlcsc.com/upload/public/pdf/source/20200305/C486355_26A10D38EF8C2A5C37091D0039909270.pdf; Supplier: LCSC; Tolerance: ±10%
C73 = CL10B104KA8NNNC: LCSC Part Name: 100nF ±10% 25V; Supplier Part: C1590; Manufacturer: SAMSUNG(三星); Supplier Footprint: 0603; JLCPCB Part Class: Extended Part; Datasheet: https://atta.szlcsc.com/upload/public/pdf/source/20160218/1457707763339.pdf; Supplier: LCSC; Tolerance: ±10%
C74 = CL32B225KCJSNNE: LCSC Part Name: 2.2uF ±10% 100V; Supplier Part: C55151; Manufacturer: SAMSUNG(三星); Supplier Footprint: 1210; JLCPCB Part Class: Extended Part; Datasheet: https://atta.szlcsc.com/upload/public/pdf/source/20160218/1457707763339.pdf; Supplier: LCSC; Tolerance: ±10%
C75 = RVT1H221M1010_C72499: Capacitance: Tolerance:±20% Tolerance:±20% Rated Voltage: Ripple Current:230mA@120Hz Equivalent Series Resistance(ESR):- φD: L: Lifetime @ Temp:2000hrs@105℃ Operating Temperature:-40℃~+105℃ Operating Temperature:-40℃~+105℃; LCSC Part Name: 220uF ±20% 50V; Supplier Part: C72499; Manufacturer: ROQANG(容强); Manufacturer Part: RVT1H221M1010; Supplier Footprint: SMD,D10xL10.2mm; JLCPCB Part Class: Extended Part; Datasheet: https://atta.szlcsc.com/upload/public/pdf/source/20170325/1490427950282.pdf; Supplier: LCSC; Tolerance: ±20%; Ripple Current: 230mA@120Hz; Lifetime @ Temp: 2000hrs@105℃; Operating Temperature: -40℃~+105℃
CN14-CN21 = DB2ERC-5.08-2P-GN: LCSC Part Name: 5.08mm 1x2P 排数:1 每排P数:2; Supplier Part: C395737; Manufacturer: DORABO(地博电气); Supplier Footprint: 弯插,P=5.08mm; JLCPCB Part Class: Extended Part; Datasheet: https://atta.szlcsc.com/upload/public/pdf/source/20230327/49BCB2D820551F12B61E36BBA9DDD5A2.pdf; Supplier: LCSC; Connector Type: 板端/Receptacle-Close; Structure: 1x2P; Pitch: 5.08mm; Color: Green; Mounting Style: Bend; Number of Pins: 2P; Number of Rows: 1; Number of PINs Per Row: 2; Current Rating (Max): 20A; Voltage Rating (Max): 320V; Operating Temperature Range: -40℃~+105℃
CN22 CN23 = DB2ERC-5.08-3P-BK: LCSC Part Name: 5.08mm 1x3P 排数:1 每排P数:3; Supplier Part: C430440; Manufacturer: DORABO(地博电气); Supplier Footprint: 弯插,P=5.08mm; JLCPCB Part Class: Extended Part; Datasheet: https://atta.szlcsc.com/upload/public/pdf/source/20230327/49BCB2D820551F12B61E36BBA9DDD5A2.pdf; Supplier: LCSC; Connector Type: 板端/Receptacle-Close; Structure: 1x3P; Pitch: 5.08mm; Color: Black; Mounting Style: Bend; Number of Pins: 3P; Number of Rows: 1; Number of PINs Per Row: 3; Current Rating (Max): 20A; Voltage Rating (Max): 320V; Operating Temperature Range: -40℃~+105℃
D33-D40 = SS54_C22452: LCSC Part Name: 电压:40V 电流:5A; Supplier Part: C22452; Manufacturer: MDD(辰达半导体); Supplier Footprint: SMA(DO-214AC); JLCPCB Part Class: Basic Part; Datasheet: https://atta.szlcsc.com/upload/public/pdf/source/20230314/529CD85F9B31F69841D3A079BC07E377.pdf; Supplier: LCSC; Diode Configuration: Single; Forward Voltage (Vf@If): 550mV@5A; Reverse Voltage (Vr): 40V; Rectified Current: 5A; Reverse Leakage Current (Ir): 1mA@40V
D41 D43 = FDLL4148: LCSC Part Name: 电压:100V 电流:200mA; Supplier Part: C78608; Manufacturer: onsemi(安森美); Supplier Footprint: SOD-80; JLCPCB Part Class: Extended Part; Datasheet: https://atta.szlcsc.com/upload/public/pdf/source/20221020/952944402E52E23E5C6A007D10038C14.pdf; Supplier: LCSC; Forward Voltage (Vf@If): 1V@10mA; Reverse Leakage Current: 5uA@75V; Operating Temperature: -55℃~+175℃
D42 = SMBJ33CA_C78420: Reverse Stand-Off Voltage (Vrwm):33V Maximum Clamping Voltage:53.3V Peak Pulse Current (Ipp)@10/1000us:11.3A Breakdown Voltage:36.7V Type:TVS; LCSC Part Name: 33V截止 11.3A峰值脉冲; Supplier Part: C78420; Manufacturer: Brightking(君耀电子); Supplier Footprint: SMB(DO-214AA); JLCPCB Part Class: Extended Part; Datasheet: https://atta.szlcsc.com/upload/public/pdf/source/20181127/C309995_EB3DFB9F9AEE5D2146ECD9FA5992A402.pdf; Supplier: LCSC; Reverse Stand-Off Voltage (Vrwm): 33V; Maximum Clamping Voltage: 53.3V; Peak Pulse Current (Ipp)@10/1000us: 11.3A; Breakdown Voltage: 36.7V; Type: TVS; polarity: Bi-Directional; Peak Pulse Power Dissipation (Ppp)@10/1000us: 600W
K1 K2 = ALQ105: Supplier Part: C719517; Manufacturer: PANASONIC(松下); Supplier Footprint: 插件,10x20mm; JLCPCB Part Class: Extended Part; Datasheet: https://atta.szlcsc.com/upload/public/pdf/source/20210111/C719517_E569CB83AE74C77274A407DFBCBCE4D6.pdf; Supplier: LCSC; Coil Voltage: 5V; Contact Form: 一组转换:1C(SPDT-转换); Maximum Switching Voltage: 250V@AC; Contact Material: AgNi; Maximum Switching Current: 10A; Operate Time: 20ms; Release Time: 20ms; Operating Temperature: -40℃~+85℃
LED7-LED15 LED17 = NCD0805R1_C84256: Supplier Part: C84256; Manufacturer: 国星光电; Supplier Footprint: 0805; JLCPCB Part Class: Basic Part; Datasheet: https://atta.szlcsc.com/upload/public/pdf/source/20200820/C84256_F0A75A43B3EAD75808600A0514C76B99.pdf; Supplier: LCSC; Emitted Color: Red; Forward Voltage (VF): 1.6V~2.6V; Power Dissipation: 65mW; Forward Current: 20mA; Dominant Wavelength: 615nm~630nm; Diode Configuration: 独立二极管; Lens Color: 无色透明透镜; Luminous Intensity: 67mcd~195mcd; Viewing Angle: 130°; Operating Temperature: -30℃~+85℃
LED16 = 17-215SURC/S530-A2/TR8: LCSC Part Name: 红灯; Supplier Part: C142306; Manufacturer: EVERLIGHT(亿光); Supplier Footprint: 0805; JLCPCB Part Class: Extended Part; Datasheet: https://atta.szlcsc.com/upload/public/pdf/source/20171110/C142306_15102792678801104249.pdf; Supplier: LCSC; Emitted Color: Red
Q2-Q4 Q8-Q10 Q14 Q15 = IRF5305STRLPBF: LCSC Part Name: 1个P沟道 耐压:55V 电流:31A; Supplier Part: C41224; Manufacturer: Infineon(英飞凌); Supplier Footprint: TO-263-2; JLCPCB Part Class: Extended Part; Datasheet: https://atta.szlcsc.com/upload/public/pdf/source/20200525/C537772_8AE22919435F731062AFC622E6C287B5.pdf; Supplier: LCSC; Type: 1个PChannel; Power Dissipation (Pd): ；; Drain Source On Resistance (RDS(on)@Vgs,Id): 60mΩ@10V,16A; Gate Threshold Voltage (Vgs(th)@Id): 4V@250uA; Total Gate Charge (Qg@Vgs): 63nC@10V; Input Capacitance (Ciss@Vds): 1.2nF@25V; Operating Temperature: -55℃~+175℃@(Tj)
Q5-Q7 Q11-Q13 Q16 Q17 Q19-Q22 = MMSS8050-L-TP: LCSC Part Name: 耐压:25V 电流:1.5A NPN; Supplier Part: C194044; Manufacturer: MCC(美微科); Supplier Footprint: SOT-23; JLCPCB Part Class: Extended Part; Datasheet: https://atta.szlcsc.com/upload/public/pdf/source/20180629/C194044_254F8BF82F81D50CDD7AC87A069B0CC8.pdf; Supplier: LCSC; DC Current Gain (hFE@Ic,Vce): 120@100mA,1V; Transition Frequency (fT): 100MHz; Collector Cut-Off Current (Icbo): 100nA; Collector-Emitter Saturation Voltage (VCE(sat)@Ic,Ib): 500mV@800mA,80mA; Operating Temperature: -55℃~+150℃@(Tj)
Q18 = DMT6005LPS-13: Supplier Part: C780843; Manufacturer: DIODES(美台); Supplier Footprint: DFN-8(5.1x6); JLCPCB Part Class: Extended Part; Datasheet: https://atta.szlcsc.com/upload/public/pdf/source/20200907/C780843_BB243DCE9D38AC8F9247AE6DAA9190FF.pdf; Supplier: LCSC
R77 R78 R80 R85 R88 R92 R95 R97 R99 R103 R106 R110 R113 R115 R119 R123 R125 R127 R130 R131 R133 R135 = 0805W8F4701T5E: LCSC Part Name: 4.7kΩ ±1% 125mW 厚膜电阻; Supplier Part: C17673; Manufacturer: UNI-ROYAL(厚声); Supplier Footprint: 0805; JLCPCB Part Class: Basic Part; Datasheet: https://atta.szlcsc.com/upload/public/pdf/source/20200306/C422600_1E6D84923E4A46A82E41ADD87F860B5C.pdf; Supplier: LCSC; Type: Thick Film Resistors; Tolerance: ±1%; Temperature Coefficient: ±100ppm/℃; Operating Temperature Range: -55℃~+155℃
R79 R81 R82 R96 R98 R100 R114 R116 R126 R132 = 0805W8F2001T5E: LCSC Part Name: 2kΩ ±1% 125mW 厚膜电阻; Supplier Part: C17604; Manufacturer: UNI-ROYAL(厚声); Supplier Footprint: 0805; JLCPCB Part Class: Basic Part; Datasheet: https://atta.szlcsc.com/upload/public/pdf/source/20200306/C422600_1E6D84923E4A46A82E41ADD87F860B5C.pdf; Supplier: LCSC; Type: Thick Film Resistors; Tolerance: ±1%; Temperature Coefficient: ±100ppm/℃; Operating Temperature Range: -55℃~+155℃
R91 R93 R94 R109 R111 R112 R122 R124 R129 R134 = 0805W8F1003T5E: Type:Thick Film Resistors Resistance:100kΩ Tolerance:±1% Tolerance:±1% Power(Watts): Overload Voltage (Max): Temperature Coefficient:±100ppm/℃ Temperature Coefficient:±100ppm/℃ Operating Temperature Range:-55℃~+155℃ Operating Temperature Range:-55℃~+155℃; LCSC Part Name: 100kΩ ±1% 125mW 厚膜电阻; Supplier Part: C149504; Manufacturer: UNI-ROYAL(厚声); Supplier Footprint: 0805; JLCPCB Part Class: Basic Part; Datasheet: https://atta.szlcsc.com/upload/public/pdf/source/20200306/C422600_1E6D84923E4A46A82E41ADD87F860B5C.pdf; Supplier: LCSC; Type: Thick Film Resistors; Tolerance: ±1%; Temperature Coefficient: ±100ppm/℃; Operating Temperature Range: -55℃~+155℃
R128 = 1206W4F4701T5E: LCSC Part Name: 4.7kΩ ±1% 250mW 厚膜电阻; Supplier Part: C17936; Manufacturer: UNI-ROYAL(厚声); Supplier Footprint: 1206; JLCPCB Part Class: Basic Part; Datasheet: https://atta.szlcsc.com/upload/public/pdf/source/20200306/C422600_1E6D84923E4A46A82E41ADD87F860B5C.pdf; Supplier: LCSC; Type: Thick Film Resistors; Tolerance: ±1%; Temperature Coefficient: ±100ppm/℃; Operating Temperature Range: -55℃~+155℃
SW3-SW12 = 2AS3T1A1M2QES: LCSC Part Name: 2A系列 钮子开关 摇头开关; Supplier Part: C908284; Manufacturer: Dailywell(德利威); Supplier Footprint: 插件; JLCPCB Part Class: Extended Part; Datasheet: https://atta.szlcsc.com/upload/public/pdf/source/20200324/C496174_EBCDD6AEC21814F002A8FCD6A6DB75DB.pdf; Supplier: LCSC; Circuit: SPDT; Mechanical Life: 3万次; Actuator Type: Cylindrical button handle; Pin Style: PCPin; Mounting Style: Straight; Operating Temperature: -40℃~+85℃
U41-U49 U52 = CYPC817(C-TP2): LCSC Part Name: DC输入 隔离电压(rms):5000V; Supplier Part: C385058; Manufacturer: OCIC(卓睿科); Supplier Footprint: SOP-4-2.54mm; JLCPCB Part Class: Extended Part; Datasheet: https://atta.szlcsc.com/upload/public/pdf/source/20190506/C385060_B90B33F1509846872C073ED092D72063.pdf; Supplier: LCSC; Input voltage type: DC; Output Type: 光电三极管; Forward Voltage: 1.2V; Output Current: 50mA; Isolation Voltage(rms): 5kV; Reverse Voltage: 6V; Receiving End Voltage: 80V; Number of Outputs: 1; Collector-Emitter Saturation Voltage (Vce(sat)@Ic,IF): 100mV@5mA,2mA; Rise time: 4us@2mA,100Ω; Fall time: 3us@2mA,100Ω; Operating Temperature: -55℃~+110℃
U50 = DBT50G-9.5-2P-BK-P OGC: Barrier Type:With Cover Plate Pitch:9.5mm Structure:1x2P Mounting Style:Straight Needle Pin Location:Corner Number of Pins:2P Number of Rows:1 Current Rating (Max):32A Voltage Rating (Max):750V Wire Gauge - AWG:12~22 Wire Gauge - mm2:4 Operating Temperatu; LCSC Part Name: 9.5mm 1x2P 每排P数:2 排数:1 直针 边脚; Supplier Part: C395958; Manufacturer: DORABO(地博电气); Supplier Footprint: 插件,P=9.5mm; JLCPCB Part Class: Extended Part; Datasheet: https://atta.szlcsc.com/upload/public/pdf/source/20230619/13ADDB604F78DE06B1EFD4F82CE20A46.pdf; Supplier: LCSC; Barrier Type: With Cover Plate; Pitch: 9.5mm; Structure: 1x2P; Mounting Style: Straight Needle; Pin Location: Corner; Number of Pins: 2P; Number of Rows: 1; Current Rating (Max): 32A; Voltage Rating (Max): 750V; Wire Gauge - AWG: 12~22; Wire Gauge - mm2: 4; Operating Temperature Range: -40℃~+105℃; Color: Black; Number of PINs Per Row: 2
U51 = LM74500QDDFRQ1: LCSC Part Name: 反极性保护控制器; Supplier Part: C5219210; Manufacturer: TI(德州仪器); Supplier Footprint: SOT-23-8-THIN; JLCPCB Part Class: Extended Part; Datasheet: https://www.ti.com/cn/lit/gpn/lm74500-q1; Supplier: LCSC; Input Voltage: 3.2V~65V; Operating Temperature	-: -40℃~+125℃
C44 C46 C55 = C0603X5R105K250NT: Capacitance: Tolerance:±10% Tolerance:±10% Voltage Rated: Temperature Coefficient:; LCSC Part Name: 1uF ±10% 25V; Supplier Part: C466771; Manufacturer: SANYEAR(叁叶源); Supplier Footprint: 0603; JLCPCB Part Class: Extended Part; Datasheet: https://atta.szlcsc.com/upload/public/pdf/source/20200102/C475251_1E30ECAC0E8AE7254982658A02A2D78C.pdf; Supplier: LCSC; Tolerance: ±10%
C45 C47-C50 C52 C54 C57 C59 = CL10B104KB8NNNC: Capacitance: Tolerance:±10% Tolerance:±10% Voltage Rated: Temperature Coefficient:; LCSC Part Name: 100nF ±10% 50V; Supplier Part: C1591; Manufacturer: SAMSUNG(三星); Supplier Footprint: 0603; JLCPCB Part Class: Extended Part; Datasheet: https://atta.szlcsc.com/upload/public/pdf/source/20160218/1457707763339.pdf; Supplier: LCSC; Tolerance: ±10%
U22 U23 = MCP23017T-E/ML: Supplier Part: C629439; Manufacturer: MICROCHIP(美国微芯); Supplier Footprint: QFN-28-EP(6x6); JLCPCB Part Class: Extended Part; Datasheet: https://atta.szlcsc.com/upload/public/pdf/source/20221209/1BF939F88C2D907BC056D7BF485E3103.pdf; Supplier: LCSC; Interface: I2C; Interrupt Output: 有中断输出; Supply Voltage: 1.8V~5.5V; Clock Frequency: 1.7MHz; Operating Temperature: -40℃~+125℃
C51 = 0603B102K101CT_C77438: LCSC Part Name: 1nF ±10% 100V; Supplier Part: C77438; Manufacturer: Walsin(华新科); Manufacturer Part: 0603B102K101CT; Supplier Footprint: 0603; JLCPCB Part Class: Extended Part; Datasheet: https://atta.szlcsc.com/upload/public/pdf/source/20190509/C384834_C04286DA86A56A9914642D37A195BF18.pdf; Supplier: LCSC; Tolerance: ±10%
C53 = GR431BR7LA102KW66L: LCSC Part Name: 1nF ±10% 2kV; Supplier Part: C161353; Manufacturer: muRata(村田); Supplier Footprint: 1206; JLCPCB Part Class: Extended Part; Datasheet: https://atta.szlcsc.com/upload/public/pdf/source/20180228/C161353_15198053236341377174.pdf; Supplier: LCSC; Tolerance: ±10%
CN1 = DB2ERC-5.08-3P-OG: LCSC Part Name: 5.08mm 1x3P 排数:1 每排P数:3; Supplier Part: C430435; Manufacturer: DORABO(地博电气); Supplier Footprint: 弯插,P=5.08mm; JLCPCB Part Class: Extended Part; Datasheet: https://atta.szlcsc.com/upload/public/pdf/source/20230327/49BCB2D820551F12B61E36BBA9DDD5A2.pdf; Supplier: LCSC; Connector Type: 板端/Receptacle-Close; Structure: 1x3P; Pitch: 5.08mm; Color: Orange; Mounting Style: Bend; Number of Pins: 3P; Number of Rows: 1; Number of PINs Per Row: 3; Current Rating (Max): 20A; Voltage Rating (Max): 320V; Operating Temperature Range: -40℃~+105℃
D13 = LL4148_C435829: LCSC Part Name: 电压:75V 电流:200mA; Supplier Part: C435829; Manufacturer: MDD(辰达半导体); Supplier Footprint: LL-34; JLCPCB Part Class: Extended Part; Datasheet: https://atta.szlcsc.com/upload/public/pdf/source/20230823/CF1FBF721ECE2AB22ACED5F4B72E76C8.pdf; Supplier: LCSC; Forward Voltage (Vf@If): 1V@10mA; Reverse Leakage Current: 5uA@75V
D14 = SMAJ6.5CA_C693489: LCSC Part Name: 双向TVS 6.5V截止 35.7A峰值脉冲; Supplier Part: C693489; Manufacturer: FTR(乔光电子); Supplier Footprint: SMA(DO-214AC); JLCPCB Part Class: Extended Part; Datasheet: https://atta.szlcsc.com/upload/public/pdf/source/20200701/C693484_1156DF04E76B06595EAEDEC163B907C7.pdf; Supplier: LCSC; polarity: Bi-Directional; Reverse Stand-Off Voltage (Vrwm): 6.5V; Maximum Clamping Voltage: 11.2V; Peak Pulse Current (Ipp)@10/1000us: 35.7A; Breakdown Voltage: 11.2V; Type: TVS
D15 = SM712_C502564: LCSC Part Name: 300W 12V 7V 双电压 ESD管; Supplier Part: C502564; Manufacturer: MDD; Supplier Footprint: SOT-23; JLCPCB Part Class: Extended Part; Datasheet: https://atta.szlcsc.com/upload/public/pdf/source/20230823/BAA798B644DA3EF7D91C046C01A2BBE5.pdf; Supplier: LCSC; Reverse Stand-Off Voltage (Vrwm): 12V；7V; Peak Pulse Current (Ipp)@10/1000us: 15A; Peak Pulse Power Dissipation (Ppp)@10/1000us: 300W; Breakdown Voltage: 7.5V；13.3V; Number of Lines: 双路; Type: ESD
D16 = 3RL150M-5-S: LCSC Part Name: 150V 5kA 3端 GDT; Supplier Part: C522540; Manufacturer: Brightking(君耀电子); Supplier Footprint: SMD-3P; JLCPCB Part Class: Extended Part; Datasheet: https://atta.szlcsc.com/upload/public/pdf/source/20200429/C522528_376A2834AFAA94CAE6B3512CFD328BE1.pdf; Supplier: LCSC; DC Spark-over Voltage: 150V
F1 F2 = BSMD1206-020-30V: LCSC Part Name: 30V 200mA 1206自恢复; Supplier Part: C883118; Manufacturer: BHFUSE(佰宏); Supplier Footprint: 1206; JLCPCB Part Class: Extended Part; Datasheet: https://atta.szlcsc.com/upload/public/pdf/source/20230512/E419278EC8529AAF514173EF221BCF4B.pdf; Supplier: LCSC; Operating Voltage (Max): 30V; Current Rating (Max): 40A; Hold Current: 200mA; Trip Current: 460mA; Power Dissipation: 600mW; Resistance - Initial (Ri) (Min): 350mΩ; Resistance - Post Trip (R1) (Max): 2.7Ω; Maximum Time to Trip: 100ms; Operating Temperature: -40℃~+85℃
H1 = 2.54-1*3P针: LCSC Part Name: 间距:2.54mm 1x3P 直插 方针; Supplier Part: C49257; Manufacturer: BOOMELE(博穆精密); Supplier Footprint: 插件,P=2.54mm; JLCPCB Part Class: Extended Part; Datasheet: https://atta.szlcsc.com/upload/public/pdf/source/20221018/3E9408392E35E6F57A28985E5F7BF5C9.pdf; Supplier: LCSC; Pin Structure: 1x3P; Pitch: 2.54mm; Circluar Pins/Square Pins: Square Pins; Mounting Type: Straight; Number of Rows: Plugin; Number of Pins: 3P; Current Rating (Max): 3A; Operating Temperature Range: -40℃~+105℃; Color: Black
R31 = PTFR0603B56K0P9: LCSC Part Name: 薄膜电阻 56kΩ ±0.1% 100mW; Supplier Part: C351640; Manufacturer: RESI(开步睿思); Supplier Footprint: 0603; JLCPCB Part Class: Extended Part; Datasheet: https://atta.szlcsc.com/upload/public/pdf/source/20240506/11BDC7478D84177AC2A5326A65B6EB29.pdf; Supplier: LCSC; Type: Thin Film Resistor; Tolerance: ±0.1%; Temperature Coefficient: ±25ppm/℃; Operating Temperature Range: -55℃~+125℃
R32 = 0603WAF1200T5E: LCSC Part Name: 120Ω ±1% 100mW 厚膜电阻; Supplier Part: C22787; Manufacturer: UNI-ROYAL(厚声); Supplier Footprint: 0603; JLCPCB Part Class: Basic Part; Datasheet: https://atta.szlcsc.com/upload/public/pdf/source/20200306/C422600_1E6D84923E4A46A82E41ADD87F860B5C.pdf; Supplier: LCSC; Type: Thick Film Resistors; Tolerance: ±1%; Temperature Coefficient: ±100ppm/℃; Operating Temperature Range: -55℃~+155℃
R33 R35 R36 = RC0603FR-074K7L: Type:Thick Film Resistors Resistance: Tolerance:±1% Tolerance:±1% Power(Watts): Overload Voltage (Max): Temperature Coefficient:±100ppm/℃ Temperature Coefficient:±100ppm/℃ Operating Temperature Range:-55℃~+155℃ Operating Temperature Range:-55℃~+155℃; LCSC Part Name: 厚膜电阻 4.7kΩ ±1% 100mW; Supplier Part: C99782; Manufacturer: YAGEO(国巨); Supplier Footprint: 0603; JLCPCB Part Class: Extended Part; Datasheet: https://atta.szlcsc.com/upload/public/pdf/source/20180224/C181757_15194369480721363983.pdf; Supplier: LCSC; Type: Thick Film Resistors; Tolerance: ±1%; Temperature Coefficient: ±100ppm/℃; Operating Temperature Range: -55℃~+155℃
U24 = 74HC04D_C86613: Supplier Part: C86613; Manufacturer: FM(富满); Supplier Footprint: SOIC-14; JLCPCB Part Class: Extended Part; Datasheet: https://atta.szlcsc.com/upload/public/pdf/source/20170103/1483435273882.pdf; Supplier: LCSC
U25 = π141E61Q: Supplier Part: C6807845; Manufacturer: 2Pai Semi(荣湃); Supplier Footprint: WBSOIC-16; JLCPCB Part Class: Extended Part; Datasheet: https://atta.szlcsc.com/upload/public/pdf/source/20230615/2A508A30CF95E47147E931271279D24B.pdf; Supplier: LCSC; Applications: General-purpose; Voltage Isolation or Not: 带电压隔离; Supply Voltage: 3V~5.5V; Data Rate: 200Mbps; Number of Channels: 4; Isolation voltage: 5000Vrms; Forward Channel: 3; Reverse channel: 1; Isolation Technology: 电容隔离; Operating Temperature: -40℃~+125℃
U26 = SP485EEN-L/TR: LCSC Part Name: 增强型低功耗半双工RS-485收发器; Supplier Part: C6855; Manufacturer: MaxLinear(迈凌); Supplier Footprint: SOIC-8; JLCPCB Part Class: Basic Part; Datasheet: https://atta.szlcsc.com/upload/public/pdf/source/20210125/C916163_66C97B5ACCC910994E8B10780F9BD300.pdf; Supplier: LCSC; Types: transceiver; Supply Voltage: 4.75V~5.25V; Data Rate: 10Mbps; Driver/receiver: 1/1; Operating Temperature: -40℃~+85℃
U27 U28 = SMAJ12CA_C3001959: LCSC Part Name: 双向TVS 12V截止 20.1A峰值脉冲; Supplier Part: C3001959; Manufacturer: UMW(友台半导体); Supplier Footprint: SMA(DO-214AC); JLCPCB Part Class: Extended Part; Datasheet: https://atta.szlcsc.com/upload/public/pdf/source/20220418/4D87B6D60C1DFB29493B09203CA0C822.pdf; Supplier: LCSC; Reverse Stand-Off Voltage (Vrwm): 12V; Maximum Clamping Voltage: 19.9V; Peak Pulse Current (Ipp)@10/1000us: 20.1A; Peak Pulse Power Dissipation (Ppp)@10/1000us: 400W; Breakdown Voltage: 13.3V; Reverse Leakage Current (Ir): 1uA; Type: TVS
B1 = CR2032-BS-6-1: LCSC Part Name: 电池底座 适用电池:CR2032; Supplier Part: C70377; Manufacturer: Q&J; Supplier Footprint: SMD; JLCPCB Part Class: Extended Part; Datasheet: https://atta.szlcsc.com/upload/public/pdf/source/20160427/1461725216549.pdf; Supplier: LCSC; Connector Type: Battery base; Battery Type: CR2032
U29 = DS3231SN#: LCSC Part Name: 超高精度、I²C接口、集成RTC/TCXO/晶体; Supplier Part: C722469; Manufacturer: ADI(亚德诺)/MAXIM(美信); Supplier Footprint: SOIC-16-300mil; JLCPCB Part Class: Extended Part; Datasheet: https://atta.szlcsc.com/upload/public/pdf/source/20170713/C118524_1499918908819816807.pdf; Supplier: LCSC; Interface: I2C; Operating Voltage: 2.3V~5.5V; Operating Temperature: -40℃~+85℃
C56 C58 = GRM188R61E106KA73D: LCSC Part Name: 10uF ±10% 25V; Supplier Part: C344022; Manufacturer: muRata(村田); Supplier Footprint: 0603; JLCPCB Part Class: Extended Part; Datasheet: https://atta.szlcsc.com/upload/public/pdf/source/20181211/C344022_BB98D43E7DA95E5A749FBFE073C8A3E0.pdf; Supplier: LCSC; Tolerance: ±10%
U30 = W25N01GVZEIG: Supplier Part: C907680; Manufacturer: WINBOND(华邦); Supplier Footprint: WSON-8-EP(6.1x8); JLCPCB Part Class: Extended Part; Datasheet: https://atta.szlcsc.com/upload/public/pdf/source/20201021/C907645_0A29D2C383E097D6F46BF0FEEFAA9DEB.pdf; Supplier: LCSC
U31 = KH-TF-07DT: LCSC Part Name: 卡座; Supplier Part: C4943323; Manufacturer: kinghelm(金航标); Supplier Footprint: SMD; JLCPCB Part Class: Extended Part; Datasheet: https://atta.szlcsc.com/upload/public/pdf/source/20220712/AFD6E7AB8D1EDF57D944C61163D92FBF.pdf; Supplier: LCSC; Connector Type: Deck

## Nets
3V3: BUZZER1.1(+) C44.1 C45.2 C46.1 C47.2 C48.2 C49.2 C54.2 C55.1 C56.1 C57.2 C58.1 C59.2 D44.1(C) R28.2 R29.2 R30.2 R37.1 R38.1 R39.1 R40.1 R41.1 R77.1 R78.1 R79.2 R80.1 R81.2 R82.2 R95.1 R96.2 R97.1 R98.2 R99.1 R100.2 R113.1 R114.2 R115.1 R116.2 R125.1 R126.2 R131.1 R132.2 U22.5(VDD) U23.5(VDD) U24.14(VCC) U25.1(VDD1) U29.2(VCC) U30.3(WP#(DQ2)) U30.7(HOLD#(DQ3)) U30.8(VCC) U31.4(VDD) ; also on sheet 1 2 11 12 14 15 16 17
+5V(ISO): C50.2 C52.2 D41.1(C) D43.1(C) K1.5 K2.5 R33.2 R34.2 R36.1 U25.16(VDD2) U26.8(VCC) U49.4(COL) U52.4(COL) ; also on sheet 1 15
GND: B1.2 C44.2 C45.1 C46.2 C47.1 C48.1 C49.1 C51.1 C54.1 C55.2 C56.2 C57.1 C58.2 C59.1 Q5.2(E) Q6.2(E) Q7.2(E) Q11.2(E) Q12.2(E) Q13.2(E) Q16.2(E) Q17.2(E) Q19.2(E) Q21.2(E) R91.1 R93.1 R94.1 R109.1 R111.1 R112.1 R122.1 R124.1 R129.1 R134.1 R137.1 SW3.1 SW4.1 SW5.1 SW6.1 SW7.1 SW8.1 SW9.1 SW10.1 SW11.1 SW12.1 U22.6(VSS) U22.11(A0) U22.12(A1) U22.13(A2) U22.29(EP) U23.6(VSS) U23.12(A1) U23.13(A2) U23.29(EP) U24.7(GND) U25.2(GND1) U25.8(GND1) U29.5(N.C.) U29.6(N.C.) U29.7(N.C.) U29.8(N.C.) U29.9(N.C.) U29.10(N.C.) U29.11(N.C.) U29.12(N.C.) U29.13(GND) U30.4(VSS) U30.9(EP) U31.6(VSS) U31.CD(EH) U31.G(EH) U53.2(E) ; also on sheet 1 2 3 4 11 12 13 14 15 16 17
GND(ISO): C50.1 C52.1 C53.1 Q20.2(E) Q22.2(E) R35.2 U25.9(GND2) U25.15(GND2) U26.5(GND) ; also on sheet 1 15
AI_SCL: U22.8(SCK) U23.8(SCK) U29.16(SCL) ; also on sheet 2 11 13 17
AI_SDA: U22.9(SDA) U23.9(SDA) U29.15(SDA) ; also on sheet 2 11 13 17
BUZZER: R136.1 U22.1(GPB4)
CTP_RST: U22.17(GPA0) ; also on sheet 2
DI_01: U23.24(GPA7) ; also on sheet 12
DI_02: U23.25(GPB0) ; also on sheet 12
DI_03: U23.26(GPB1) ; also on sheet 12
DI_04: U23.27(GPB2) ; also on sheet 12
DI_05: U23.28(GPB3) ; also on sheet 12
DI_06: U23.1(GPB4) ; also on sheet 12
DISP: U22.18(GPA1) ; also on sheet 4
DO_01: R85.1 U22.2(GPB5)
DO_02: R92.1 U22.3(GPB6)
DO_03: R88.1 U22.4(GPB7)
DO_04: R103.1 U23.17(GPA0)
DO_05: R110.1 U23.18(GPA1)
DO_06: R106.1 U23.19(GPA2)
DO_07: R119.1 U23.20(GPA3)
DO_08: R123.1 U23.21(GPA4)
DO_09: R127.1 U23.22(GPA5)
DO_10: R133.1 U23.23(GPA6)
DO_GND: C74.1 C75.2 C76.1 CN14.2 CN15.2 CN16.2 CN17.2 CN18.2 CN19.2 CN20.2 CN21.2 D33.1(A) D34.1(A) D35.1(A) D36.1(A) D37.1(A) D38.1(A) D39.1(A) D40.1(A) D42.1 LED16.1(K) U41.3(EMI) U42.3(EMI) U43.3(EMI) U44.3(EMI) U45.3(EMI) U46.3(EMI) U47.3(EMI) U48.3(EMI) U50.2 U51.2(GND)
DO_VCC: C74.2 C75.1 Q2.3(S) Q3.3(S) Q4.3(S) Q8.3(S) Q9.3(S) Q10.3(S) Q14.3(S) Q15.3(S) Q18.5(D) Q18.6(D) Q18.7(D) Q18.8(D) R83.2 R86.2 R89.2 R101.2 R104.2 R107.2 R117.2 R120.2 R128.2
EARTH: C53.2 CN1.3 D15.3 D16.3 U27.1(K) U28.1(K)
EXTIO2: U22.19(GPA2) ; also on sheet 2
EXTIO3: U22.20(GPA3) ; also on sheet 4
EXTIO4: R38.2 U22.21(GPA4) U31.2(CD/DAT3)
EXTIO5: R41.2 U22.22(GPA5) U30.1(CS#)
EXTIO6: U22.23(GPA6) ; also on sheet 14
EXTIO7: U22.24(GPA7) ; also on sheet 14
EXTIO8: U22.25(GPB0) ; also on sheet 14
EXTIO9: U22.26(GPB1) ; also on sheet 16
EXTIO10: U22.27(GPB2) ; also on sheet 16
EXTIO11: U22.28(GPB3) ; also on sheet 16
FL_MISO: R39.2 U30.2(DO(DQ1)) U31.7(DAT0) ; also on sheet 2 14
FL_MOSI: R37.2 U30.5(DI(DQ0)) U31.3(CMD) ; also on sheet 2 14
FL_SCK: R40.2 U30.6(CLK) U31.5(CLX) ; also on sheet 2 14
IO15: U24.1(1A) U25.4(VIB) ; also on sheet 2 15
IO16: U25.6(VOD) ; also on sheet 2 15
RS485_RXD': R34.1 U25.11(VID) U26.1(RO)
RS485_TXD': U25.13(VOB) U26.4(DI)
RS485_TXDEN: U24.6(3Y) U25.3(VIA)
RS485_TXDEN': R33.1 U25.14(VOA) U26.2(RE#) U26.3(DE)
RS485A: CN1.1 D16.1 F2.2
RS485A': D14.1 D15.1 F2.1 H1.2 H1.3 R36.2 U26.6(A) U28.2(A)
RS485B: CN1.2 D16.2 F1.2
RS485B': D14.2 D15.2 F1.1 R32.1 R35.1 U26.7(B) U27.2(A)
$5N1271: U24.2(1Y) U24.3(2A)
$5N1275: D13.1(C) R31.2 U24.4(2Y)
$5N1276: C51.2 D13.2(A) R31.1 U24.5(3A)
$5N1307: H1.1 R32.2
$7N377: B1.1 U29.14(VBAT)
$9N499: R28.1 U22.14(RESET#)
$9N1204: R29.1 U23.14(RESET#)
$9N4301: R30.1 U23.11(A0)
$10N266: Q5.1(B) R85.2 R91.2
$10N268: R77.2 U41.1(AN)
$10N982: Q2.1(G) R84.2
$10N1020: R83.1 R84.1 U41.4(COL)
$10N2354: CN14.1 D33.2(K) Q2.4(D)
$10N2891: LED7.1(+) R79.1
$10N5492: Q5.3(C) SW3.3
$10N6135: LED7.2(-) SW3.2 U41.2(CAT)
$10N32910: Q6.1(B) R92.2 R93.2
$10N32912: R78.2 U42.1(AN)
$10N32913: Q3.1(G) R87.2
$10N32914: R86.1 R87.1 U42.4(COL)
$10N32918: LED8.1(+) R81.1
$10N32920: Q6.3(C) SW4.3
$10N32925: LED8.2(-) SW4.2 U42.2(CAT)
$10N33476: Q7.1(B) R88.2 R94.2
$10N33478: R80.2 U43.1(AN)
$10N33479: Q4.1(G) R90.2
$10N33480: R89.1 R90.1 U43.4(COL)
$10N33484: LED9.1(+) R82.1
$10N33486: Q7.3(C) SW5.3
$10N33491: LED9.2(-) SW5.2 U43.2(CAT)
$10N34042: Q11.1(B) R103.2 R109.2
$10N34044: R95.2 U44.1(AN)
$10N34045: Q8.1(G) R102.2
$10N34046: R101.1 R102.1 U44.4(COL)
$10N34050: LED10.1(+) R96.1
$10N34052: Q11.3(C) SW6.3
$10N34057: LED10.2(-) SW6.2 U44.2(CAT)
$10N34608: Q12.1(B) R110.2 R111.2
$10N34610: R97.2 U45.1(AN)
$10N34611: Q9.1(G) R105.2
$10N34612: R104.1 R105.1 U45.4(COL)
$10N34616: LED11.1(+) R98.1
$10N34618: Q12.3(C) SW7.3
$10N34623: LED11.2(-) SW7.2 U45.2(CAT)
$10N35174: Q17.1(B) R123.2 R124.2
$10N35176: R115.2 U48.1(AN)
$10N35177: Q15.1(G) R121.2
$10N35178: R120.1 R121.1 U48.4(COL)
$10N35182: LED14.1(+) R116.1
$10N35184: Q17.3(C) SW10.3
$10N35189: LED14.2(-) SW10.2 U48.2(CAT)
$10N35740: Q13.1(B) R106.2 R112.2
$10N35742: R99.2 U46.1(AN)
$10N35743: Q10.1(G) R108.2
$10N35744: R107.1 R108.1 U46.4(COL)
$10N35748: LED12.1(+) R100.1
$10N35750: Q13.3(C) SW8.3
$10N35755: LED12.2(-) SW8.2 U46.2(CAT)
$10N36306: Q16.1(B) R119.2 R122.2
$10N36308: R113.2 U47.1(AN)
$10N36309: Q14.1(G) R118.2
$10N36310: R117.1 R118.1 U47.4(COL)
$10N36314: LED13.1(+) R114.1
$10N36316: Q16.3(C) SW9.3
$10N36321: LED13.2(-) SW9.2 U47.2(CAT)
$10N40719: Q19.3(C) SW11.3
$10N40722: Q19.1(B) R127.2 R129.2
$10N40728: R125.2 U49.1(AN)
$10N40729: LED15.2(-) SW11.2 U49.2(CAT)
$10N40730: LED15.1(+) R126.1
$10N40970: D41.2(A) K1.1 Q20.3(C)
$10N40972: R130.1 U49.3(EMI)
$10N40974: CN22.2 K1.2(COM)
$10N40975: CN22.1 K1.3(N.O.)
$10N40976: Q20.1(B) R130.2
$10N41567: Q21.1(B) R133.2 R134.2
$10N41569: R131.2 U52.1(AN)
$10N41572: LED17.1(+) R132.1
$10N41574: Q21.3(C) SW12.3
$10N41575: LED17.2(-) SW12.2 U52.2(CAT)
$10N41577: D43.2(A) K2.1 Q22.3(C)
$10N41580: R135.1 U52.3(EMI)
$10N41582: CN23.2 K2.2(COM)
$10N41583: CN23.1 K2.3(N.O.)
$10N41584: Q22.1(B) R135.2
$10N46101: C72.1 C76.2
$10N46171: C73.1 U51.4(VCAP)
$10N50404: Q18.4(G) U51.6(GATE)
$10N50906: C72.2 C73.2 D42.2 Q18.1(S) Q18.2(S) Q18.3(S) U50.1 U51.1(EN) U51.5(SOURCE)
$10N155742: CN22.3 K1.4(N.C.)
$10N155749: CN23.3 K2.4(N.C.)
$10N163948: LED16.2(A) R128.1
$10N168268: CN15.1 D34.2(K) Q3.4(D)
$10N168275: CN16.1 D35.2(K) Q4.4(D)
$10N168282: CN17.1 D36.2(K) Q8.4(D)
$10N168289: CN18.1 D37.2(K) Q9.4(D)
$10N168296: CN19.1 D38.2(K) Q10.4(D)
$10N168303: CN20.1 D39.2(K) Q14.4(D)
$10N168310: CN21.1 D40.2(K) Q15.4(D)
$11N286: R136.2 R137.2 U53.1(B)
$11N287: BUZZER1.2 D44.2(A) U53.3(C)

Not connected (* = marked no-connect by the designer): BUZZER1 3* 4*; U22 7(NC)* 10(NC)* 15(INTB)* 16(INTA)*; U23 2(GPB5)* 3(GPB6)* 4(GPB7)* 7(NC)* 10(NC)* 15(INTB)* 16(INTA)*; U24 8(4Y)* 9(4A)* 10(5Y)* 11(5A)* 12(6Y)* 13(6A)*; U25 5(VIC)* 7(NC/EN1)* 10(NC/EN2)* 12(VOC)*; U29 1(32KHZ)* 3(INT#/SQW)* 4(RST#)*; U31 1(DAT2)* 8(DAT1)*; U51 3(N.C)* 7(N.C)* 8(N.C)*

## Notes on the sheets
sheet 5
- Inverter
- Digital/Power isolater
- RS485
- Links:
- 1. https://www.waveshare.com/wiki/ESP32-S3-Relay-6CH
sheet 6
- RTC
- Fixed ADDR : 0x68
- Links:
- 1. https://learn.adafruit.com/adafruit-ds3231-precision-rtc-breakout/downloads
- 2. https://www.lcsc.com/datasheet/lcsc_datasheet_2310091153_Analog-Devices-Inc--Maxim-Integrated-DS3231SN-_C722469.pdf
sheet 7
- Storage
- SD Card
- SPI NAND Flash
- Links:
- 1. https://www.waveshare.com/wiki/ESP32-S3-Touch-LCD-7
- 2. https://www.lcsc.com/datasheet/lcsc_datasheet_2304140030_Winbond-Elec-W25N01GVZEIG_C907680.pdf
- 3. https://learn.adafruit.com/assets/116721
- 4. https://cdn-learn.adafruit.com/assets/assets/000/116/721/original/components_schem.png?1668619694
sheet 8
- I/O Expander
- ADDR : 0x20
- ADDR : 0x21
- Links:
- 1. https://learn.adafruit.com/adafruit-mcp23017-i2c-gpio-expander/downloads
- 2. https://dfimg.dfrobot.com/nobody/wiki/3ce3119985b8f9f527018369cbe7be41.pdf
sheet 9
- Digital Output - MOSFET
- DO 1
- DO 2
- DO 3
- DO 4
- DO 5
- DO 6
- DO 7
- DO 8
- Digital Output - Relay
- Digital Output Power Supply
- DO 9
- DO 10
- Links:
- 1. https://robojax.com/learn/arduino/?vid=robojax_e-switch_IRF5305
- 2. https://www.waveshare.com/wiki/ESP32-S3-Relay-6CH
sheet 10
- Buzzer
- Links:
- 1. https://www.waveshare.com/wiki/ESP32-S3-Relay-6CH
